# EAGLE design quadcopter (EAGLE 9.7.0)
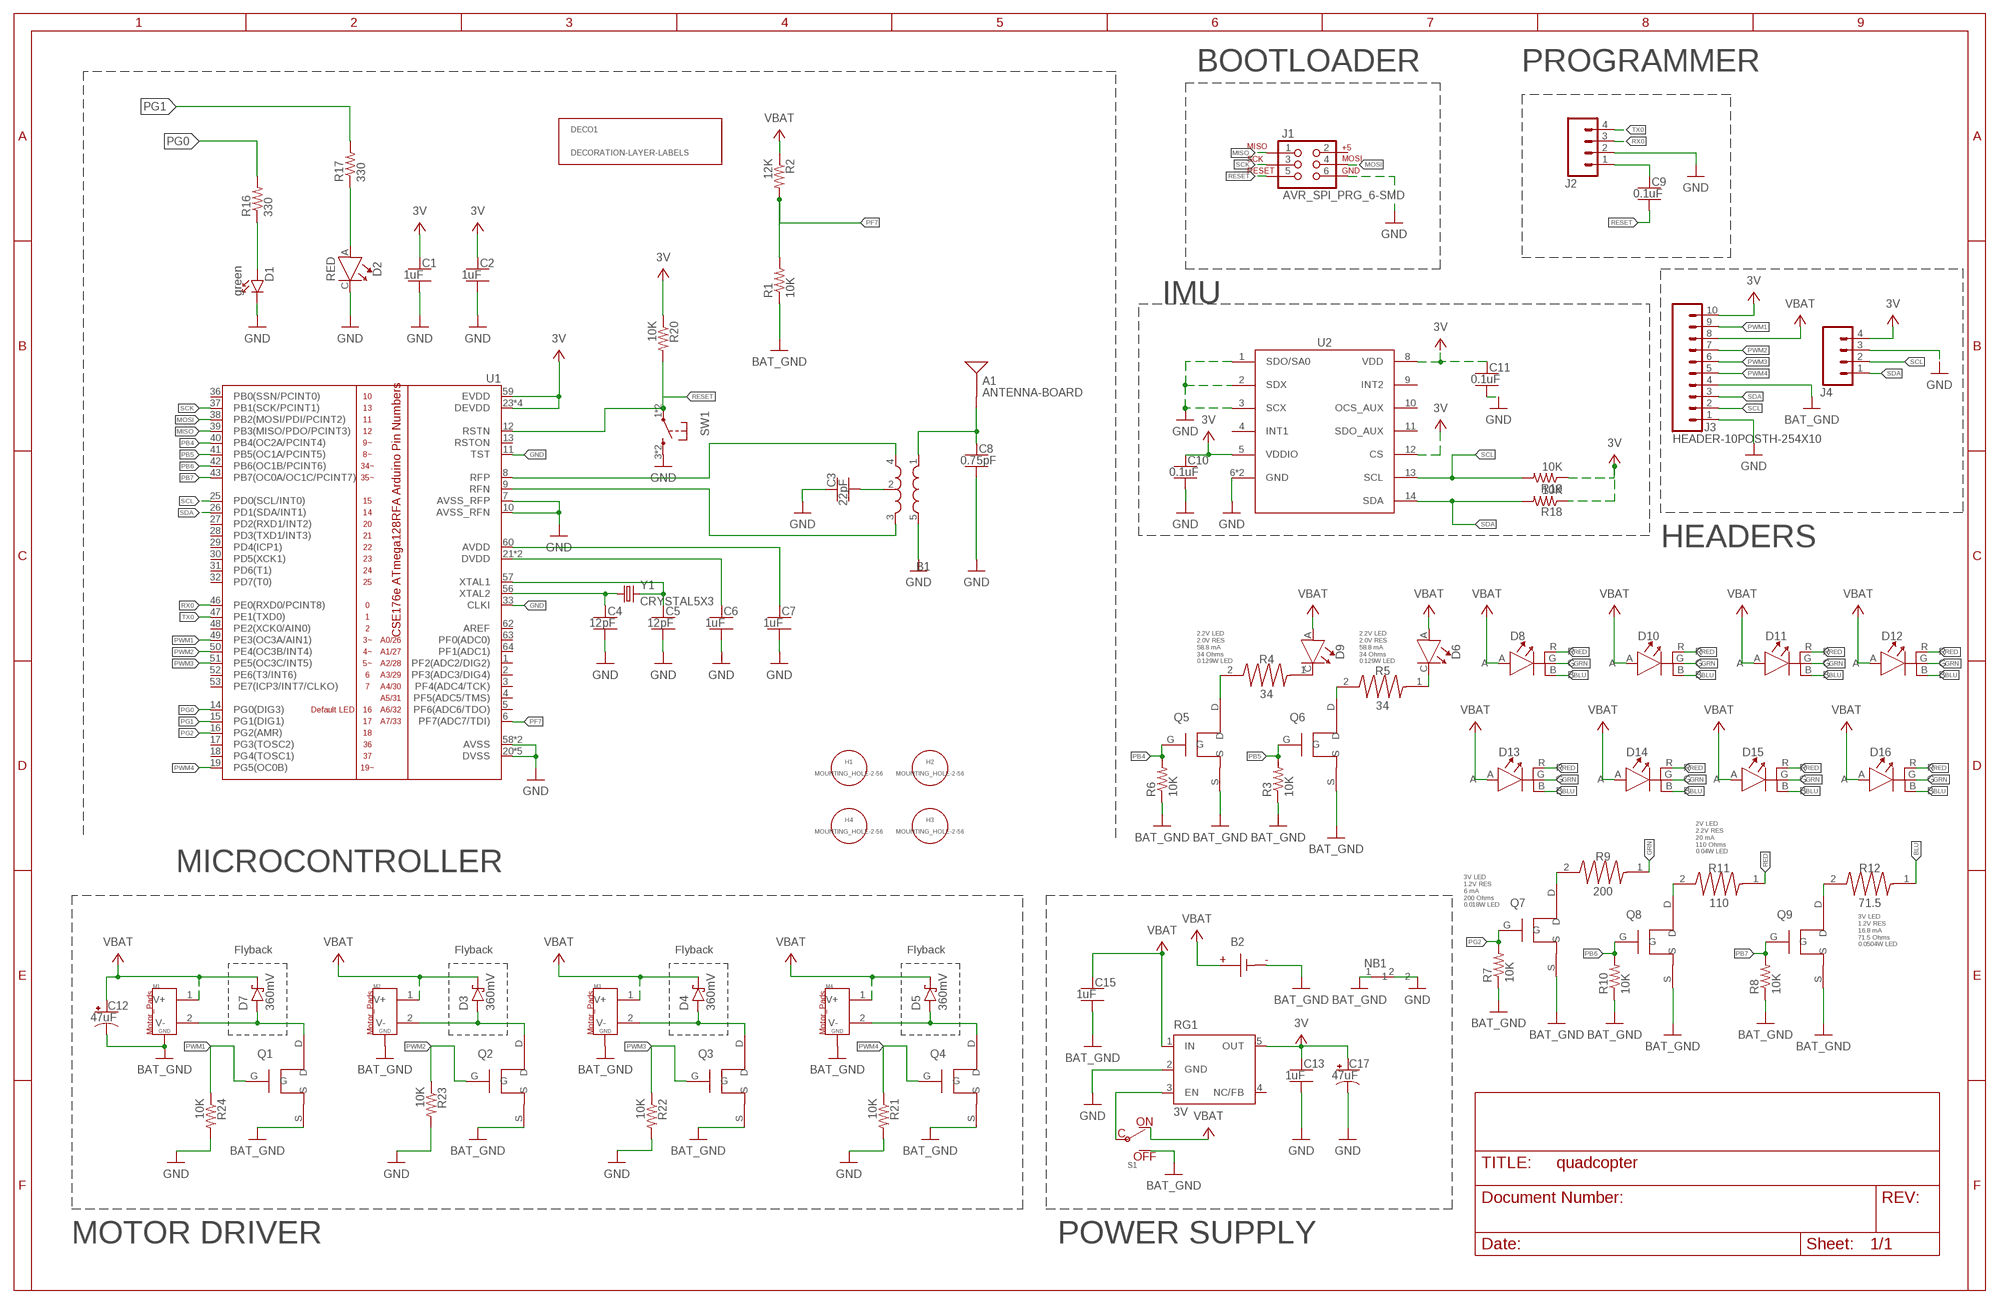
[diagram p0: schematic, sheet 1]
FRAME1 (FRAME_B_L): CREATOR: Unknown; DIST: Unknown; DISTPN: Unknown

## Parts
A1  ANTENNA-BOARD  [ANT_PCB_2.4GHZ_NRF8001_1.6MM_1OZ]
B1  BALUN0805  [BALUN]
B2  BATTERY-SCREW-TERMINAL  [SCREW-TERMINAL-1X2-2.54MM]
C1  1uF  CAPACITOR-NP_SMD-2012-0805_CERAMIC-1UF  [CAPC2012X140_HS]
C2  1uF  CAPACITOR-NP_SMD-2012-0805_CERAMIC-1UF  [CAPC2012X140_HS]
C3  22pF  CAPACITOR-NP_SMD-2012-0805_CERAMIC-22PF  [CAPC2012X140_HS]
C4  12pF  CAPACITOR-NP_SMD-2012-0805_CERAMIC-12PF  [CAPC2012X140_HS]
C5  12pF  CAPACITOR-NP_SMD-2012-0805_CERAMIC-12PF  [CAPC2012X140_HS]
C6  1uF  CAPACITOR-NP_SMD-2012-0805_CERAMIC-1UF  [CAPC2012X140_HS]
C7  1uF  CAPACITOR-NP_SMD-2012-0805_CERAMIC-1UF  [CAPC2012X140_HS]
C8  0.75pF  CAPACITOR-NP_SMD-2012-0805_CERAMIC-0.75PF  [CAPC2012X140_HS]
C9  0.1uF  CAPACITOR-NP_SMD-2012-0805_CERAMIC-0.1UF  [CAPC2012X140_HS]
C10  0.1uF  CAPACITOR-NP_SMD-2012-0805_CERAMIC-0.1UF  [CAPC2012X140_HS]
C11  0.1uF  CAPACITOR-NP_SMD-2012-0805_CERAMIC-0.1UF  [CAPC2012X140_HS]
C12  47uF  CAPACITOR-POL_47UF-SMD-1206-TAJA  [CAPMP3216X180]
C13  1uF  CAPACITOR-NP_SMD-2012-0805_CERAMIC-1UF  [CAPC2012X140_HS]
C15  1uF  CAPACITOR-NP_SMD-2012-0805_CERAMIC-1UF  [CAPC2012X140_HS]
C17  47uF  CAPACITOR-POL_47UF-SMD-1206-TAJA  [CAPMP3216X180]
D1  green  DIODE-LED_SMD-2012-0805-GREEN  [LEDSC125X200X120-2_HS]
D2  RED  LED-RED-LED  [LEDC1507X80]
D3  360mV  DIODE-SCHOTTKY_-SMD-SOD123  [SODFL3516X96]
D4  360mV  DIODE-SCHOTTKY_-SMD-SOD123  [SODFL3516X96]
D5  360mV  DIODE-SCHOTTKY_-SMD-SOD123  [SODFL3516X96]
D6  LED-YELLOW-LED  [LEDQLSP30YK]
D7  360mV  DIODE-SCHOTTKY_-SMD-SOD123  [SODFL3516X96]
D8  RGB-LED-DIFFUSE-LED  [LED150080M153000]
D9  LED-YELLOW-LED  [LEDQLSP30YK]
D10  RGB-LED-DIFFUSE-LED  [LED150080M153000]
D11  RGB-LED-DIFFUSE-LED  [LED150080M153000]
D12  RGB-LED-DIFFUSE-LED  [LED150080M153000]
D13  RGB-LED-DIFFUSE-LED  [LED150080M153000]
D14  RGB-LED-DIFFUSE-LED  [LED150080M153000]
D15  RGB-LED-DIFFUSE-LED  [LED150080M153000]
D16  RGB-LED-DIFFUSE-LED  [LED150080M153000]
DECO1  DECORATION-LAYER-LABELS  [LAYER_LABELS]
H1  MOUNTING_HOLE-2-56  [2-56-MOUNTING-HOLE-NO-METAL]
H2  MOUNTING_HOLE-2-56  [2-56-MOUNTING-HOLE-NO-METAL]
H3  MOUNTING_HOLE-2-56  [2-56-MOUNTING-HOLE-NO-METAL]
H4  MOUNTING_HOLE-2-56  [2-56-MOUNTING-HOLE-NO-METAL]
J1  AVR_SPI_PRG_6-SMD  [2X3-SMD]
J2  HEADER-4POS-0.1IN-FEMALE-SMD-BOTTOM-ENTRY  [HEADER-1X4-BOTTOM-ENTRY]
J3  HEADER-10POSTH-254X10  [HDRV10W63P254_10X1_2540X254H838_HS]
J4  HEADER-4POS-0.1IN-FEMALE-SMD-BOTTOM-ENTRY  [HEADER-1X4-BOTTOM-ENTRY]
M1  MOTOR_PADS_GND-MOLEX-SMD  [MOLEX-0532610271]
M2  MOTOR_PADS_GND-MOLEX-SMD  [MOLEX-0532610271]
M3  MOTOR_PADS_GND-MOLEX-SMD  [MOLEX-0532610271]
M4  MOTOR_PADS_GND-MOLEX-SMD  [MOLEX-0532610271]
NB1  NET-BRIDGE  [NET_BRIDGE]
Q1  MOSFET-SI2302CDS-T1-E3CT-ND  [SOT95P240X110-3MOSFET]
Q2  MOSFET-SI2302CDS-T1-E3CT-ND  [SOT95P240X110-3MOSFET]
Q3  MOSFET-SI2302CDS-T1-E3CT-ND  [SOT95P240X110-3MOSFET]
Q4  MOSFET-SI2302CDS-T1-E3CT-ND  [SOT95P240X110-3MOSFET]
Q5  MOSFET-SI2302CDS-T1-E3CT-ND  [SOT95P240X110-3MOSFET]
Q6  MOSFET-SI2302CDS-T1-E3CT-ND  [SOT95P240X110-3MOSFET]
Q7  MOSFET-SI2302CDS-T1-E3CT-ND  [SOT95P240X110-3MOSFET]
Q8  MOSFET-SI2302CDS-T1-E3CT-ND  [SOT95P240X110-3MOSFET]
Q9  MOSFET-SI2302CDS-T1-E3CT-ND  [SOT95P240X110-3MOSFET]
R1  10K  RESISTOR_SMD-2012-0805-10K  [RESC2012X60_HS]
R2  12K  RESISTOR_SMD-2012-0805-12K  [RESC2012X60_HS]
R3  10K  RESISTOR_SMD-2012-0805-10K  [RESC2012X60_HS]
R4  34  MY-RESISTOR-080534OHMRES  [0805_RESISTOR]
R5  34  MY-RESISTOR-080534OHMRES  [0805_RESISTOR]
R6  10K  RESISTOR_SMD-2012-0805-10K  [RESC2012X60_HS]
R7  10K  RESISTOR_SMD-2012-0805-10K  [RESC2012X60_HS]
R8  10K  RESISTOR_SMD-2012-0805-10K  [RESC2012X60_HS]
R9  200  MY-RESISTOR-805200OHMRES  [0805_RESISTOR]
R10  10K  RESISTOR_SMD-2012-0805-10K  [RESC2012X60_HS]
R11  110  MY-RESISTOR-805110OHMRES  [0805_RESISTOR]
R12  71.5  MY-RESISTOR-080571.5OHMRES  [0805_RESISTOR]
R16  330  RESISTOR_SMD-2012-0805-330  [RESC2012X60_HS]
R17  330  RESISTOR_SMD-2012-0805-330  [RESC2012X60_HS]
R18  10K  RESISTOR_SMD-2012-0805-10K  [RESC2012X60_HS]
R19  10K  RESISTOR_SMD-2012-0805-10K  [RESC2012X60_HS]
R20  10K  RESISTOR_SMD-2012-0805-10K  [RESC2012X60_HS]
R21  10K  RESISTOR_SMD-2012-0805-10K  [RESC2012X60_HS]
R22  10K  RESISTOR_SMD-2012-0805-10K  [RESC2012X60_HS]
R23  10K  RESISTOR_SMD-2012-0805-10K  [RESC2012X60_HS]
R24  10K  RESISTOR_SMD-2012-0805-10K  [RESC2012X60_HS]
RG1  3V  TPS73633-DBVT3V  [SOT23-DBV]
S1  POWER-SWITCH-MFS201N-9-Z-SMD-EDGE  [JS102011SAQN]
SW1  PUSHBUTTON_SMD-VERTICAL-1  [TE_FSM8JSMA_HS]
U1  ATMEGA128RFA1  [QFN-64]
U2  LSM-IMU-497-18367-1-NDIMU  [LSM6DS0-IMU]
Y1  CRYSTAL5X3  [CRYSTAL-SMD-5X3]

## Nets
3V [PWR]: C1.1 C2.1 C10.1 C11.1 C13.1 C17.1(+) J3.10 J4.4 R18.1 R19.1 R20.1 RG1.5(OUT) U1.23(DEVDD) U1.34(DEVDD) U1.44(DEVDD) U1.54(DEVDD) U1.59(EVDD) U2.5(VDDIO) U2.8(VDD) U2.12(CS)
BAT_GND [HIGHCURRENT]: B2.1(N) C12.2(-) C15.2 J3.4 M1.G1(GND) M1.G2(GND) M2.G1(GND) M2.G2(GND) M3.G1(GND) M3.G2(GND) M4.G1(GND) M4.G2(GND) NB1.1 Q1.S Q2.S Q3.S Q4.S Q5.S Q6.S Q7.S Q8.S Q9.S R1.1 R3.1 R6.1 R7.1 R8.1 R10.1 S1.A(OFF)
BLU: D8.B D10.B D11.B D12.B D13.B D14.B D15.B D16.B R12.1
GND [PWR]: B1.5(GND) C1.2 C2.2 C3.1 C4.2 C5.2 C6.2 C7.2 C8.2 C10.2 C11.2 C13.2 C17.2(-) D1.C D2.C J1.6 J2.2 J3.1 J4.3 NB1.2 R21.2 R22.2 R23.2 R24.2 RG1.2(GND) SW1.3 SW1.4 U1.7(AVSS_RFP) U1.10(AVSS_RFN) U1.11(TST) U1.20(DVSS) U1.24(DVSS) U1.33(CLKI) U1.35(DVSS) U1.45(DVSS) U1.55(DVSS) U1.58(AVSS) U1.61(AVSS) U2.1(SDO/SA0) U2.2(SDX) U2.3(SCX) U2.6(GND) U2.7(GND)
GRN: D8.G D10.G D11.G D12.G D13.G D14.G D15.G D16.G R9.1
MISO: J1.1 U1.39(PB3(MISO/PDO/PCINT3))
MOSI: J1.4 U1.38(PB2(MOSI/PDI/PCINT2))
N$1: D1.A R16.1
N$2: D2.A R17.1
N$3: B1.4(OUT1) U1.8(RFP)
N$4: B1.3(OUT2) U1.9(RFN)
N$5: B1.2(GND) C3.2
N$6: C5.1 U1.57(XTAL1) Y1.3
N$7: C4.1 U1.56(XTAL2) Y1.1
N$8: C7.1 U1.60(AVDD)
N$9: C6.1 U1.21(DVDD) U1.22(DVDD)
N$10 [RFSIG]: A1.FEED(SIGNAL) B1.1(IN) C8.1
N$11: C9.1 J2.1
N$12: D9.C R4.1
N$13: Q6.D R5.2
N$14 [HIGHCURRENT]: D7.2(A) M1.2(V-) Q1.D
N$15 [HIGHCURRENT]: D3.2(A) M2.2(V-) Q2.D
N$16 [HIGHCURRENT]: D4.2(A) M3.2(V-) Q3.D
N$17 [HIGHCURRENT]: D5.2(A) M4.2(V-) Q4.D
N$18: D6.C R5.1
N$19: Q7.D R9.2
N$20: RG1.3(EN) S1.C
N$22: Q8.D R11.2
N$23: Q5.D R4.2
N$25: Q9.D R12.2
PB4: Q5.G R6.2 U1.40(PB4(OC2A/PCINT4))
PB5: Q6.G R3.2 U1.41(PB5(OC1A/PCINT5))
PB6: Q8.G R10.2 U1.42(PB6(OC1B/PCINT6))
PB7: Q9.G R8.2 U1.43(PB7(OC0A/OC1C/PCINT7))
PF7: R1.2 R2.2 U1.6(PF7(ADC7/TDI))
PG0: R16.2 U1.14(PG0(DIG3))
PG1: R17.2 U1.15(PG1(DIG1))
PG2: Q7.G R7.2 U1.16(PG2(AMR))
PWM1: J3.9 Q1.G R24.1 U1.49(PE3(OC3A/AIN1))
PWM2: J3.7 Q2.G R23.1 U1.50(PE4(OC3B/INT4))
PWM3: J3.6 Q3.G R22.1 U1.51(PE5(OC3C/INT5))
PWM4: J3.5 Q4.G R21.1 U1.19(PG5(OC0B))
RED: D8.R D10.R D11.R D12.R D13.R D14.R D15.R D16.R R11.1
RESET: C9.2 J1.5 R20.2 SW1.1 SW1.2 U1.12(RSTN)
RX0: J2.3 U1.46(PE0(RXD0/PCINT8))
SCK: J1.3 U1.37(PB1(SCK/PCINT1))
SCL: J3.2 J4.2 R19.2 U1.25(PD0(SCL/INT0)) U2.13(SCL)
SDA: J3.3 J4.1 R18.2 U1.26(PD1(SDA/INT1)) U2.14(SDA)
TX0: J2.4 U1.47(PE1(TXD0))
VBAT [HIGHCURRENT]: B2.2(P) C12.1(+) C15.1 D3.1(C) D4.1(C) D5.1(C) D6.A D7.1(C) D8.A D9.A D10.A D11.A D12.A D13.A D14.A D15.A D16.A J3.8 M1.1(V+) M2.1(V+) M3.1(V+) M4.1(V+) R2.1 RG1.1(IN) S1.B(ON)
Unconnected: J1.2 RG1.4(NC/FB) U1.1(PF2(ADC2/DIG2)) U1.2(PF3(ADC3/DIG4)) U1.3(PF4(ADC4/TCK)) U1.4(PF5(ADC5/TMS)) U1.5(PF6(ADC6/TDO)) U1.13(RSTON) U1.17(PG3(TOSC2)) U1.18(PG4(TOSC1)) U1.27(PD2(RXD1/INT2)) U1.28(PD3(TXD1/INT3)) U1.29(PD4(ICP1)) U1.30(PD5(XCK1)) U1.31(PD6(T1)) U1.32(PD7(T0)) U1.36(PB0(SSN/PCINT0)) U1.48(PE2(XCK0/AIN0)) U1.52(PE6(T3/INT6)) U1.53(PE7(ICP3/INT7/CLKO)) U1.62(AREF) U1.63(PF0(ADC0)) U1.64(PF1(ADC1)) U2.4(INT1) U2.9(INT2) U2.10(OCS_AUX) U2.11(SDO_AUX)

## Notes on the sheet
- BOOTLOADER
- PROGRAMMER
- IMU
- HEADERS
- 2.2V LED
  2.0V RES
  58.8 mA
  34 Ohms
  0.129W LED
- 2.2V LED
  2.0V RES
  58.8 mA
  34 Ohms
  0.129W LED
- 2V LED
  2.2V RES
  20 mA
  110 Ohms
  0.04W LED
- MICROCONTROLLER
- 3V LED
  1.2V RES
  6 mA
  200 Ohms
  0.018W LED
- Flyback | Flyback | Flyback | Flyback
- 3V LED
  1.2V RES
  16.8 mA
  71.5 Ohms
  0.0504W LED
- MOTOR DRIVER | POWER SUPPLY

## Library data of the parts
A1 = quadparts_prebuilt_2022:ANTENNA: Single endded antenna.; CREATOR: Swanson; DESC: trace antenna; DIST: NA; DISTPN: NA; MFR: NA; MOUNTING: NONE; MPN: NA; POPULATE: NO
B1 = quadparts_prebuilt_2022:BALUN: A balun to convert differential radio-frequency outputs from the microcontroller into a single-ended driver for the antenna.; CREATOR: Swanson; DATASHEET: http://katalog.we-online.de/pbs/datasheet/748421245.pdf; DESC: BALUN 2.4GHZ-2.5GHZ 50/100 0805; DIST: Digikey; DISTPN: 732-2230-1-ND; MFR: Wurth Electronics Inc.; MOUNTING: SMD; MPN: 748421245; PACKAGE: 0805; PRICE: 2.63; REVIEWER: Swanson
B2 = quadparts_prebuilt_2022:BATTERY: Connections for a battery.; CREATOR: Swanson; DIST: DIGIKEY; DISTPN: ED10561-ND; MOUNTING: TH; PIN1: -; PIN2: +
C1 C2 C6 C7 C13 C15 = quadparts_prebuilt_2022:CAPACITOR-NP_: Nonpolarized capacitor; CREATOR: Swanson; DIST: Digikey; DISTPN: 587-1281-1-ND; MFR: Taiyo Yuden; MOUNTING: SMD; MPN: TMK212B7105KG-T; REVIEWER: Swanson
C3 = quadparts_prebuilt_2022:CAPACITOR-NP_: Nonpolarized capacitor; CREATOR: Swanson; DESC: CAP CER 22PF 250V C0G/NP0 0805; DIST: Digikey; DISTPN: 490-5534-1-ND; MFR: Murata Electronics; MOUNTING: SMD; MPN: GRM21A5C2E220JW01D; PACKAGE: 0805; REVIEWER: Swanson
C4 C5 = quadparts_prebuilt_2022:CAPACITOR-NP_: Nonpolarized capacitor; CREATOR: Swanson; DESC: CAP CER 12PF 250V C0G/NP0 0805; DIST: Digikey; DISTPN: 490-5531-1-ND; MFR: Murata Electronics; MOUNTING: SMD; MPN: GRM21A5C2E120JW01D; PACKAGE: 0805; REVIEWER: Swanson
C8 = quadparts_prebuilt_2022:CAPACITOR-NP_: Nonpolarized capacitor; CREATOR: Swanson; DESC: CAP CER 0.75PF 100V C0G/NP0 0805; DIST: Digikey; DISTPN: 490-3585-1-ND; MFR: Murata Electronics; MOUNTING: SMD; MPN: GQM2195C2AR75CB01D; PACKAGE: 0805; REVIEWER: Swanson
C9-C11 = quadparts_prebuilt_2022:CAPACITOR-NP_: Nonpolarized capacitor; CREATOR: Swanson; DESC: CAP CER 0.1UF 100V X7R 0805; DIST: Digikey; DISTPN: 445-1418-1-ND; MFR: TDK Corporation; MOUNTING: SMD; MPN: C2012X7R2A104K125AA; PACKAGE: 0805; REVIEWER: Swanson
C12 C17 = quadparts_prebuilt_2022:CAPACITOR-POL_: Polarized capacitor; CREATOR: Swanson; DESC: CAP TANT 47UF 10% 6.3V 1206; DIST: DIGIKEY; DISTPN: 478-11462-1-ND; MFR: AVX Corporation; MOUNTING: SMD; MPN: TAJA476K006SNJV; PACKAGE: 1206
D1 = quadparts_prebuilt_2022:DIODE-LED_: Light emitting diode; CREATOR: Swanson; DIST: Digikey; DISTPN: 160-1179-1-ND; MFR: Lite-On Inc; MOUNTING: SMD; MPN: LTST-C170GKT; REVIEWER: Swanson
D2 = custom_:LED; CREATOR: ELENA; DIST: Digikey; DISTPN: 160-1178-1-ND
D3-D5 D7 = quadparts_prebuilt_2022:DIODE-SCHOTTKY_: Schottky diode; CREATOR: Swanson; DESC: DIODE SCHOTTKY 30V 1.5A SFLAT; DIST: Digikey; DISTPN: CRS08QMCT-ND; MFR: Toshiba Semiconductor and Storage; MOUNTING: SMD; MPN: CRS08(TE85L,Q,M); REVIEWER: Swanson
D6 D9 = LED:LED; CREATOR: Elaine Chao; DIST: DigiKey; DISTPN: 3970-QLSP30YKCT-ND
D8 D10-D16 = LED:RGB-LED; CREATOR: Elaine Chao; DIST: DigiKey; DISTPN: 732-11392-1-ND
DECO1 = quadparts_prebuilt_2022:DECORATION
H1-H4 = quadparts_prebuilt_2022:MOUNTING_HOLE
J1 = quadparts_prebuilt_2022:AVR_SPI_PRG_6: AVR ISP 6 Pin This is the in-system programming (ISP) connector for Atmel Microcontrollers programming.; CREATOR: Swanson; DESC: CONN HEADER SMD 6POS 2.54MM; DIST: Digikey; DISTPN: 609-3487-2-ND; MFR: Amphenol ICC (FCI); MOUNTING: SMD; MPN: 95278-101A06LF
J2 J4 = quadparts_prebuilt_2022:HEADER-4POS; CREATOR: Swanson; DESC: CONN RCPT 4POS 0.1 GOLD SMD; DIST: DIGIKEY; DISTPN: A121787CT-ND; MFR: TE Connectivity AMP Connectors; MOUNTING: SMD; MPN: 1241152-4
J3 = quadparts_prebuilt_2022:HEADER-10POS: 10 pin single inline pin header, socket, or connector; CREATOR: Swanson; DATASHEET: http://portal.fciconnect.com/Comergent//fci/drawing/68000.pdf; DIST: Digikey; DISTPN: 609-3250-ND; MFR: Amphenol FCI; MOUNTING: TH; MPN: 68000-110HLF; PRICE: 0.55; REVIEWER: Swanson
M1-M4 = quadparts_prebuilt_2022:MOTOR_PADS_GND: Connections a brushed motor.; CREATOR: Swanson; DESC: CONN HEADER SMD R/A 2POS 1.25MM; DIST: DIGIKEY; DISTPN: WM7620CT-ND; MFR: Molex; MOUNTING: SMD; MPN: 532610271
NB1 = custom_:NET-BRIDGE; CREATOR: ELAINE; DIST: NA; DISTPN: NA
Q1-Q9 = custom_:MOSFET; CREATOR: ELENA; DIST: Digikey; DISTPN: SI2302CDS-T1-E3CT-ND
R1 R3 R6-R8 R10 R18-R24 = quadparts_prebuilt_2022:RESISTOR_: Resistor; CREATOR: Swanson; DESC: RES SMD 10K OHM 5% 1/8W 0805; DIST: Digikey; DISTPN: 311-10KARCT-ND; MFR: Yageo; MOUNTING: SMD; MPN: RC0805JR-0710KL; PACKAGE: 0805; REVIEWER: Swanson
R2 = quadparts_prebuilt_2022:RESISTOR_: Resistor; CREATOR: Swanson; DIST: DIGIKEY; DISTPN: YAG3692CT-ND; MOUNTING: SMD
R4 R5 = custom_:MY-RESISTOR; CREATOR: Elaine Chao; DIST: DigiKey; DISTPN: 311-34.0CRCT-ND
R9 = custom_:MY-RESISTOR; CREATOR: Elaine Chao; DIST: DigiKey; DISTPN: 311-200CRCT-ND
R11 = custom_:MY-RESISTOR; CREATOR: Elaine Chao; DIST: DigiKey; DISTPN: 311-110CRCT-ND
R12 = custom_:MY-RESISTOR; CREATOR: Elaine Chao; DIST: DigiKey; DISTPN: 311-71.5CRCT-ND
R16 R17 = quadparts_prebuilt_2022:RESISTOR_: Resistor; CREATOR: Swanson; DIST: Digikey; DISTPN: 311-330ARCT-ND; MFR: Yageo; MOUNTING: SMD; MPN: RC0805JR-07330RL; REVIEWER: Swanson
RG1 = quadparts_prebuilt_2022:TPS73633-DBVT: LP3985-series voltage regulators.; CREATOR: Swanson; DATASHEET: http://www.ti.com/lit/ds/symlink/lp3985.pdf; DIST: Digikey; DISTPN: LP3985IM5X-3.0/NOPBCT-ND; MFR: Texas Instruments; MOUNTING: SMD; MPN: LP3985IM5X-3.0/NOPB; PRICE: 0.59; REVIEWER: Swanson
S1 = quadparts_prebuilt_2022:POWER-SWITCH-MFS201N-9-Z; CREATOR: Swanson; DESC: SWITCH SLIDE SPDT 300MA 6V; DIST: DIGIKEY; DISTPN: 401-1999-1-ND; MFR: C&K; MOUNTING: SMD; MPN: JS102011SAQN
SW1 = quadparts_prebuilt_2022:PUSHBUTTON_: "Tactile" or "clicky" button.; CREATOR: Swanson; DIST: Digikey; DISTPN: 450-1129-ND; MFR: TE Connectivity Alcoswitch Switches; MOUNTING: SMD; MPN: FSM4JSMA; REVIEWER: Swanson
U1 = quadparts_prebuilt_2022:ATMEGA128RFA1: ATmega128RFA1 8-bit AVR Microcontroller with Low Power 2.4GHz Transceiver for ZigBee and IEEE 802.15.4; CREATOR: Swanson; DATASHEET: http://www.atmel.com/Images/Atmel-8266-MCU_Wireless-ATmega128RFA1_Datasheet.pdf; DESC: IC RF TXRX+MCU 802.15.4 64VFQFN; DIST: Digikey; DISTPN: ATMEGA128RFA1-ZU-ND; MFR: Microchip Technology; MOUNTING: SMD; MPN: ATMEGA128RFA1-ZU; PACKAGE: QFN; PRICE: 10.21; REVIEWER: Swanson
U2 = custom_:LSM-IMU; CREATOR: ELENA; DIST: Digikey; DISTPN: 497-18367-1-ND
Y1 = quadparts_prebuilt_2022:CRYSTAL: Crystals to provide clock references for microcontrollers, etc.; CREATOR: Swanson; DATASHEET: http://www.abracon.com/Resonators/abm3b.pdf; DESC: CRYSTAL 16.0000MHZ 18PF SMD; DIST: Digikey; DISTPN: 535-9122-1-ND; MFR: Abracon LLC; MOUNTING: SMD; MPN: ABM3B-16.000MHZ-B2-T; PRICE: 0.68; PROD_ID: XTAL-08218; REVIEWER: Swanson

## Net classes
1 RFSIG: width 1.27 mm
2 PWR: width 0.254 mm
3 HIGHCURRENT: width 0.762 mm, drill 0.61 mm

## Board
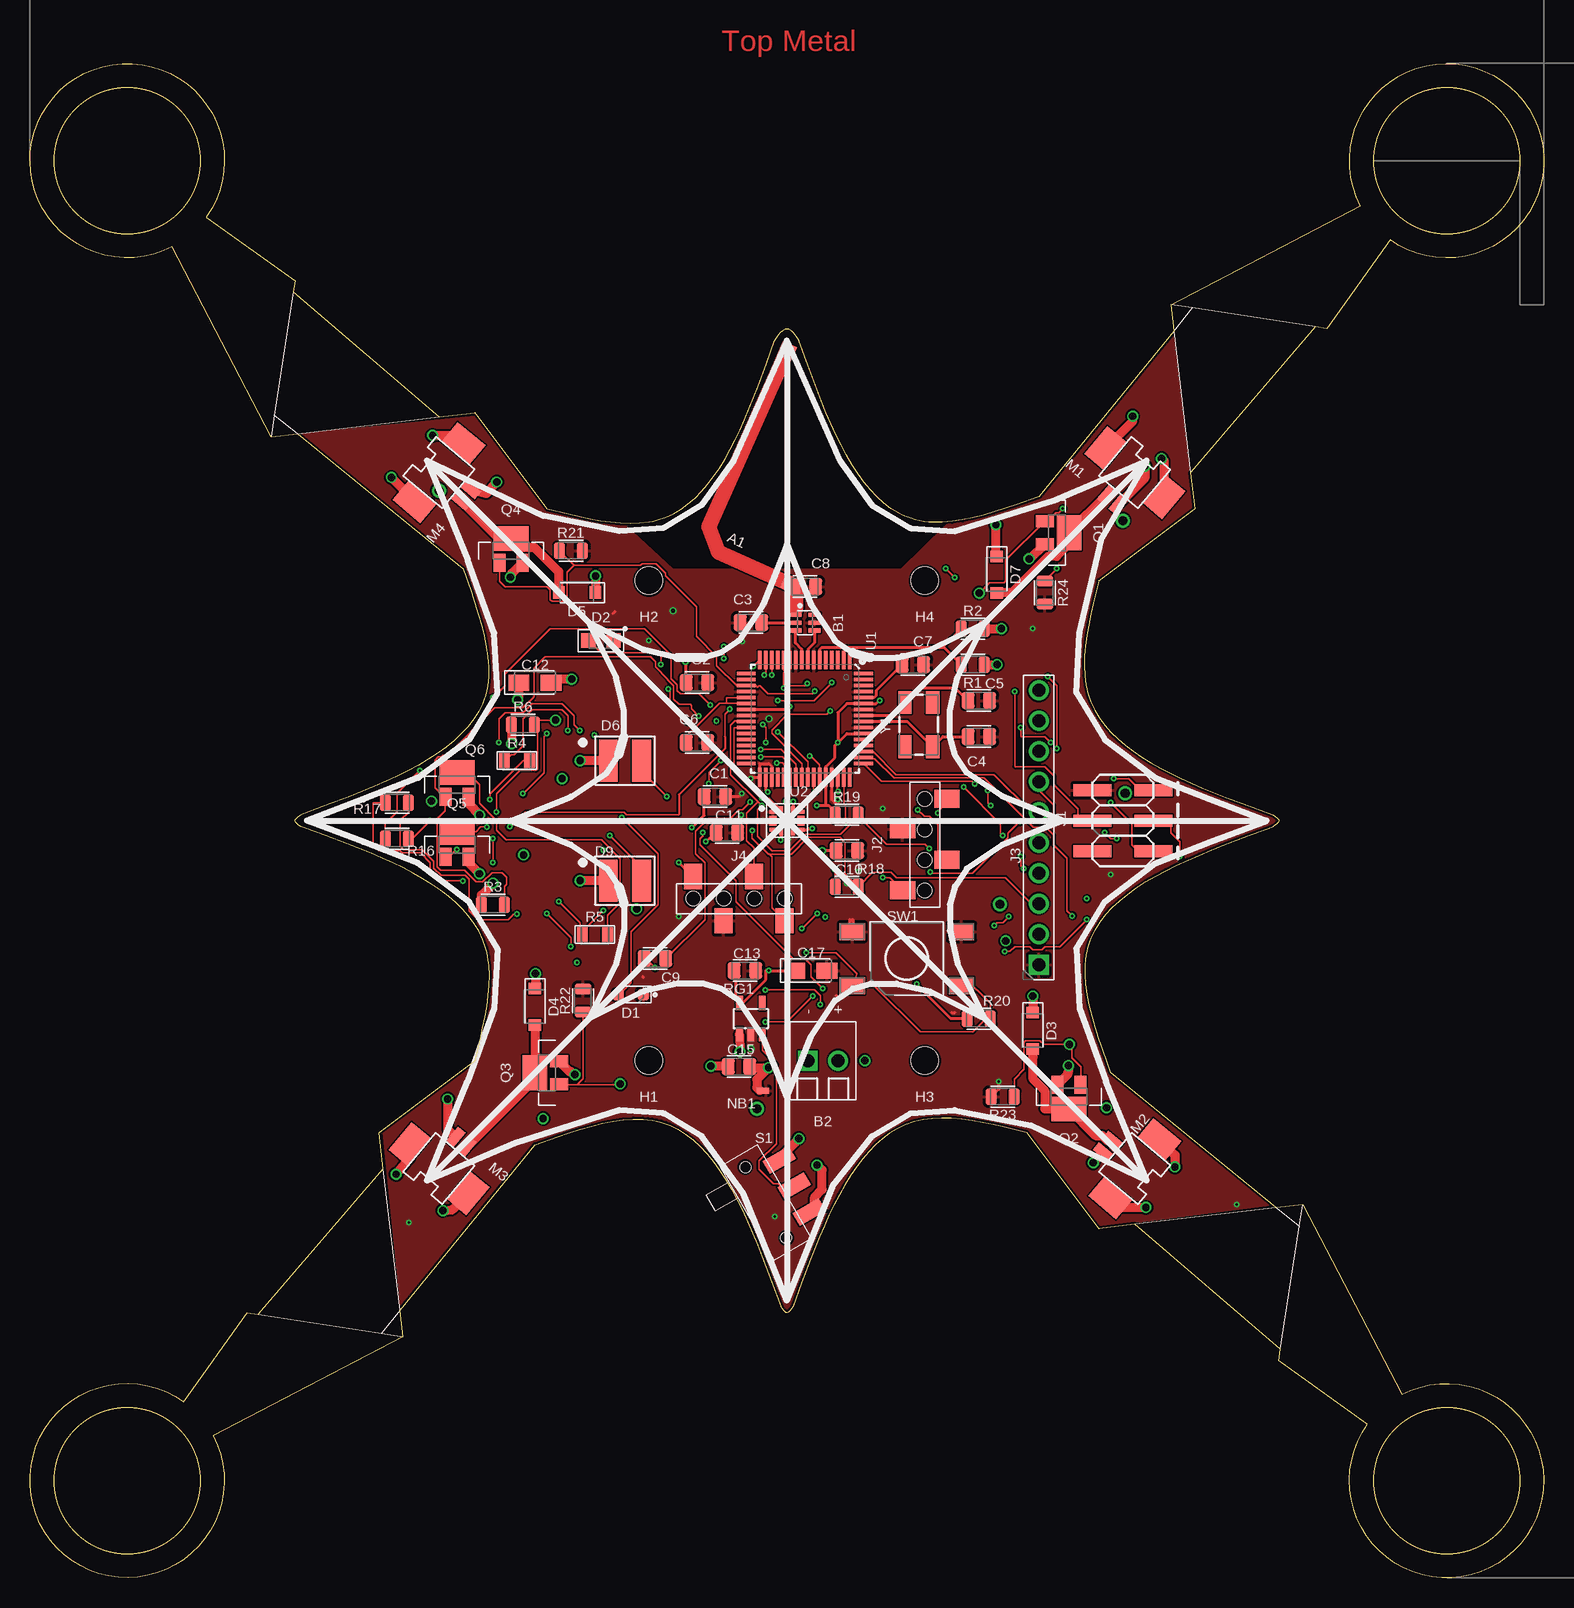
[diagram p1: board, top side]
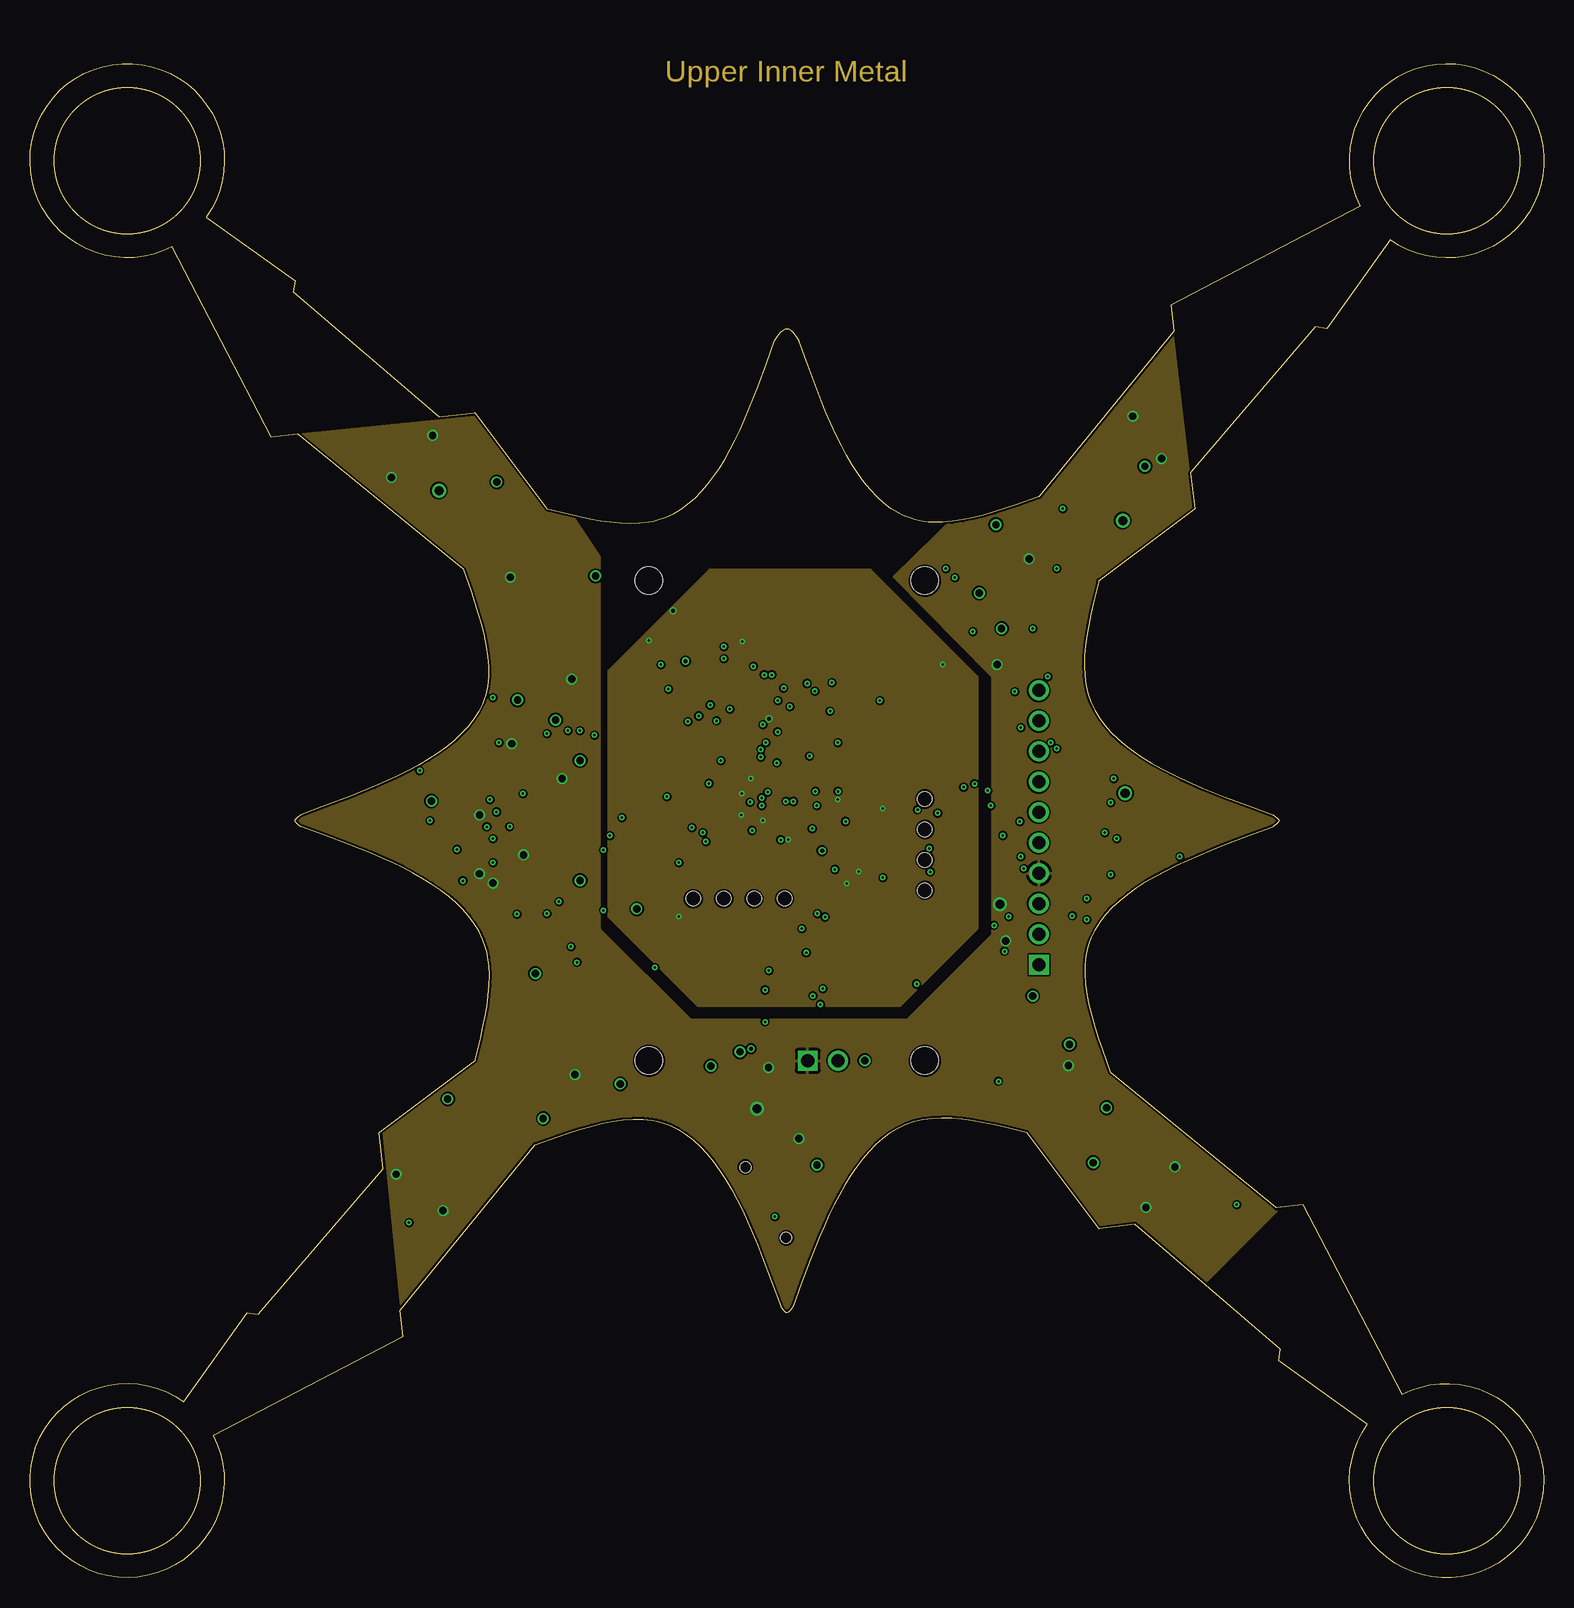
[diagram p2: board, inner layer Route2]
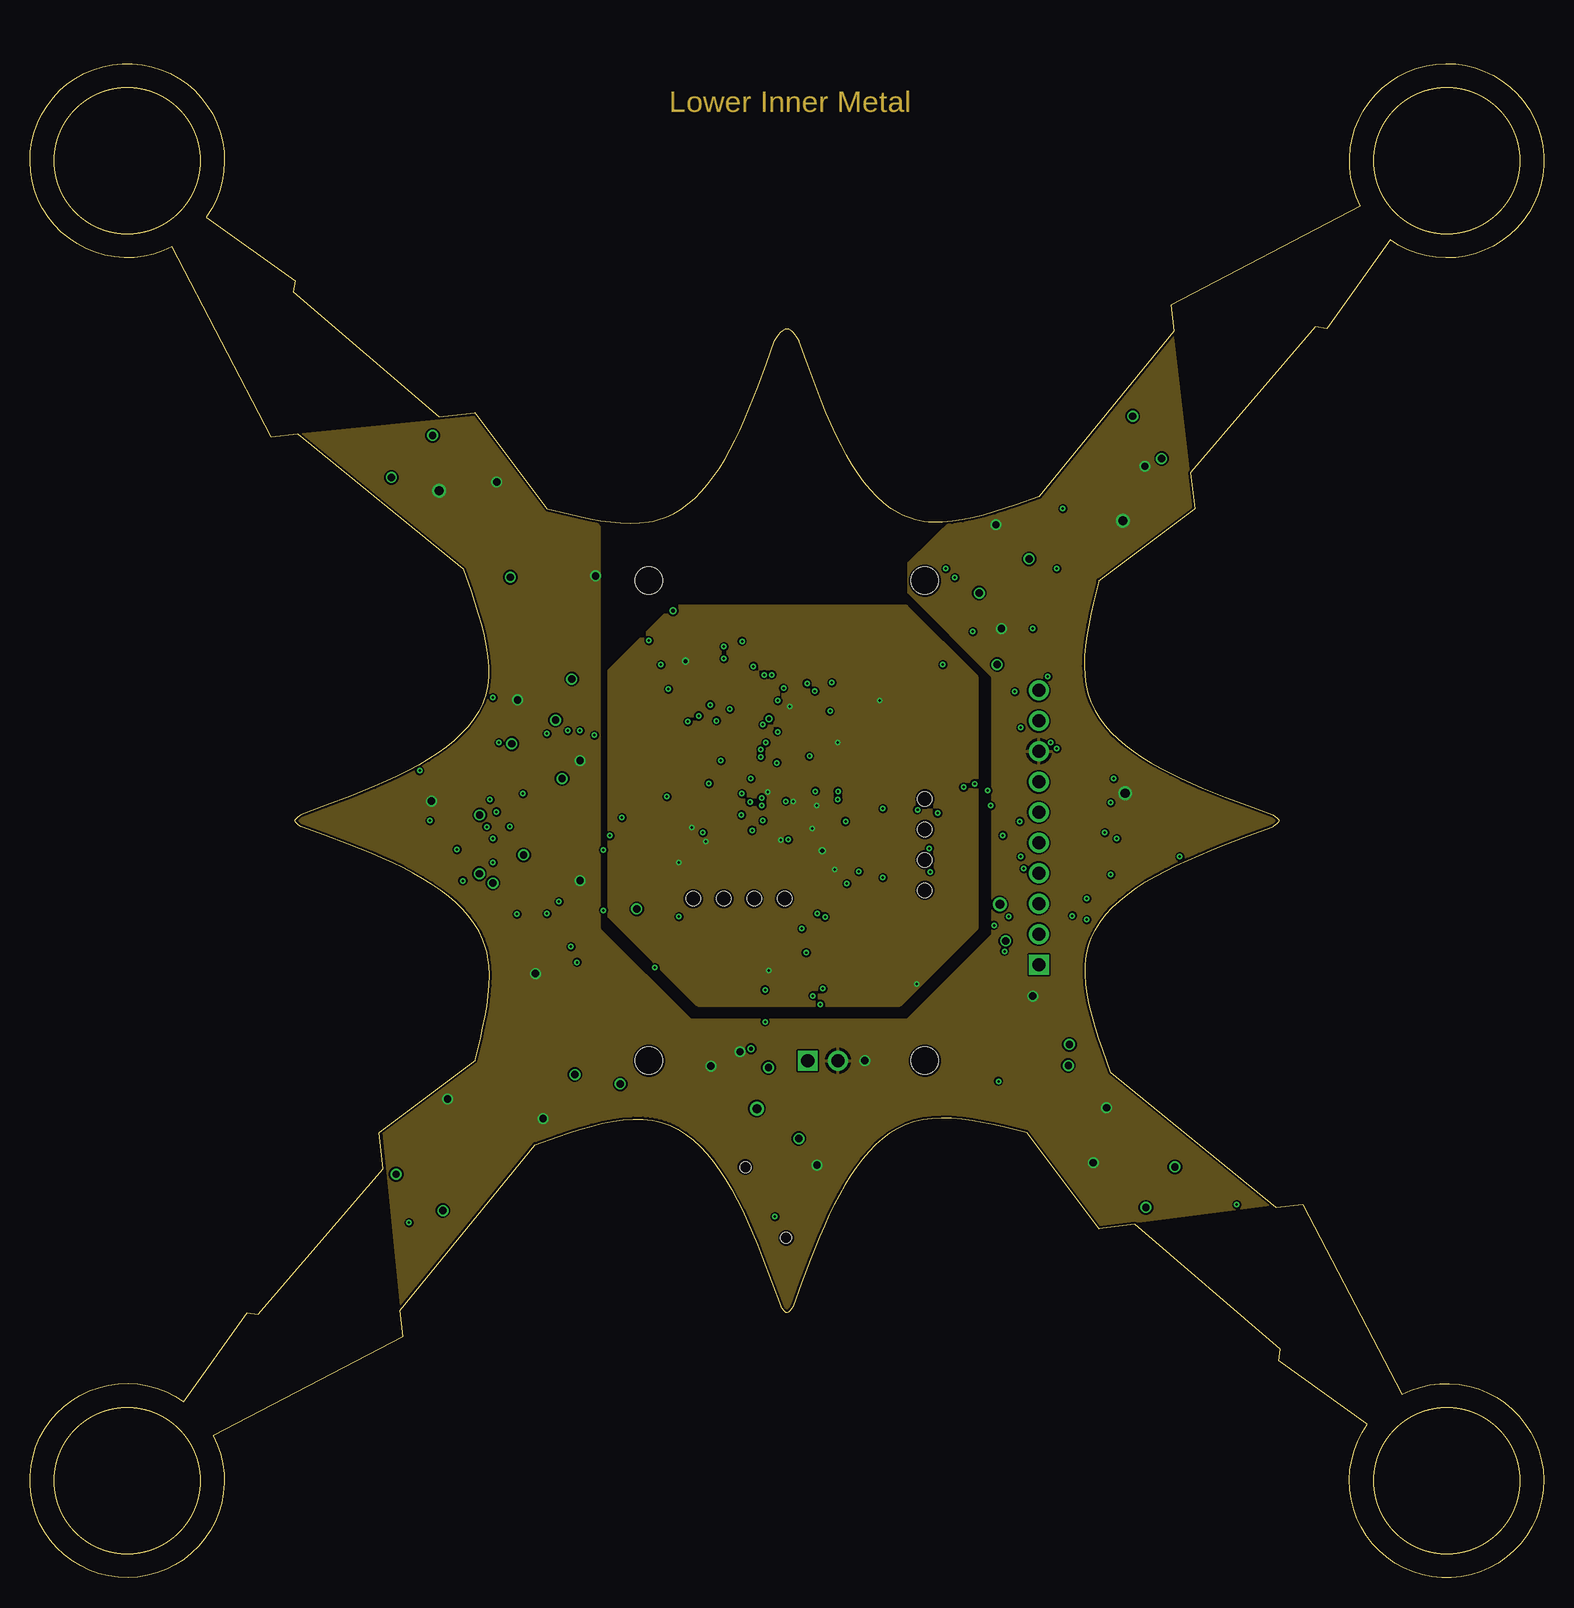
[diagram p3: board, inner layer Route15]
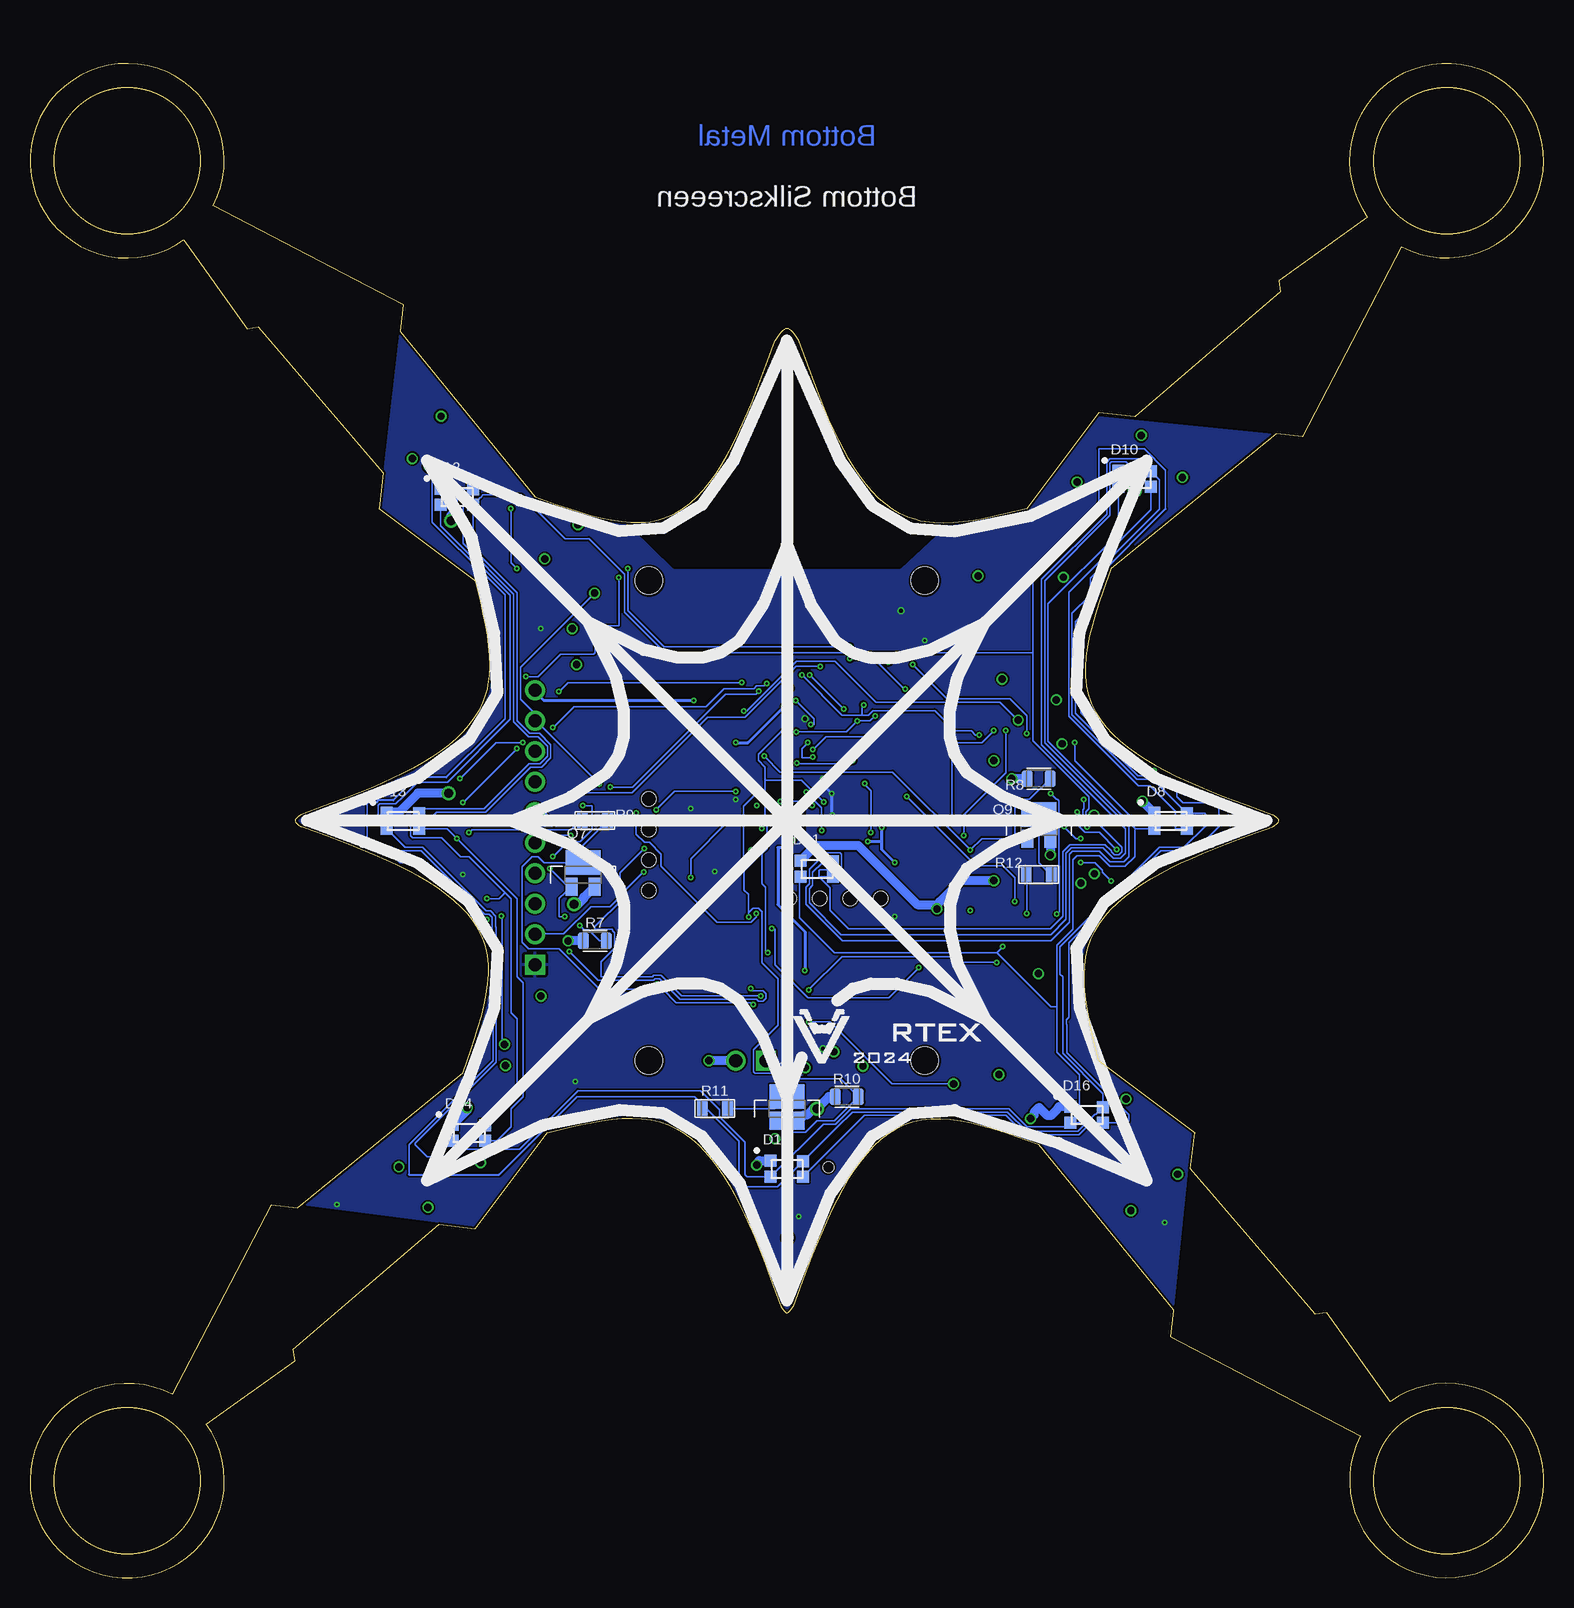
[diagram p4: board, bottom side, seen from below]

Size 126.19 x 126.19 mm. Coordinates in mm from the lower left corner, seen from the top.
Outline: 326 segments
Outline: circle at 118.1,118.1 radius 6.1
Outline: circle at 118.1,8.1 radius 6.1
Outline: circle at 8.1,8.1 radius 6.1
Outline: circle at 8.1,118.1 radius 6.1
Copper layers (1*2*15*16): Top 0.035559375mm / dielectric 1.501140625mm / Route2 0.035559375mm / dielectric 0.149859375mm / Route15 0.035559375mm / dielectric 0.200659375mm / Bottom 0.035559375mm
Design rules "pcbcart-4layer-5mil-small-cream.dru": minimum track width 5mil, minimum drill 8mil, track to track 6mil, track to pad 6mil, pad to pad 6mil, via to via 6mil, smd to smd 6mil, copper to edge 0.2mm, drill to drill 10mil, minimum pad ring 5mil, minimum via ring 5mil, stop-mask expansion 3mil, vias tented up to drill 0.45mm, thermal gap 10mil

### Footprints (pad centres in the part's own frame; a part is rotated, then mirrored left to right if it is on the bottom)
ANT_PCB_2.4GHZ_NRF8001_1.6MM_1OZ = smd 1.27 x 1.27: FEED 0,0; TESTPOINT -8.169,17.605
BALUN = smd 0.35 x 1: 1 -0.65,-0.8; 2 0,-0.8; 3 0.65,-0.8; 4 0.65,0.8; 5 0,0.8; 6 -0.65,0.8
SCREW-TERMINAL-1X2-2.54MM = drill 1.1 square: 1 -1.27,0 | drill 1.1: 2 1.27,0
CAPC2012X140_HS = smd 1.08 x 1.42: 1 -0.895,0; 2 0.895,0
CAPMP3216X180 = smd 1.735 x 1.315: 1 -1.34,0; 2 1.34,0
LEDSC125X200X120-2_HS = smd 0.94 x 0.99: A -1.045,0; C 1.045,0
LEDC1507X80 = smd 1.2 x 1.2: A -1.05,0; C 1.05,0
SODFL3516X96 = smd 0.962 x 1.029: 1 -1.525,0; 2 1.525,0
LEDQLSP30YK = smd 1.55 x 3.5: A -1.385,0; C 1.385,0
LED150080M153000 = smd 1 x 1: A -1.35,0.675; B -1.35,-0.675; G 1.35,-0.675; R 1.35,0.625
2-56-MOUNTING-HOLE-NO-METAL = hole 2.261: 0,0
2X3-SMD = smd 1 x 3.15: 1 -2.54,-2.54; 2 -2.54,2.54; 3 0,-2.54; 4 0,2.54; 5 2.54,-2.54; 6 2.54,2.54
HEADER-1X4-BOTTOM-ENTRY = smd 1.5 x 2.1: 1 3.81,-1.85; 2 1.27,1.85; 3 -1.27,-1.85; 4 -3.81,1.85 | hole 1.2: -1.27,0; -3.81,0; 1.27,0; 3.81,0
HDRV10W63P254_10X1_2540X254H838_HS = drill 1.1 pad 1.65 square: 1 0,0 | drill 1.1 pad 1.65: 2 2.54,0; 3 5.08,0; 4 7.62,0; 5 10.16,0; 6 12.7,0; 7 15.24,0; 8 17.78,0; 9 20.32,0; 10 22.86,0
MOLEX-0532610271 = smd 0.8 x 1.6: 1 -0.637,2.9; 2 0.613,2.9 | smd 2.1 x 3: G1 -3.175,0; G2 3.175,0
NET_BRIDGE = smd 0.5 x 0.5: 1 -0.25,0; 2 0.25,0
SOT95P240X110-3MOSFET = smd 2.9 x 2.05: D 0,1.025 | smd 1 x 1.5: G -0.95,-1; S 0.95,-1
RESC2012X60_HS = smd 0.92 x 1.38: 1 -0.955,0; 2 0.955,0
0805_RESISTOR = smd 0.9 x 1.2: 1 -1.05,0; 2 1.05,0
SOT23-DBV = smd 0.55 x 1.2: 1 -0.95,-1.3; 2 0,-1.3; 3 0.95,-1.3; 4 0.95,1.3; 5 -0.95,1.3
JS102011SAQN = smd 1.2 x 2.5: A -2.5,2.75; B 2.5,2.75; C 0,2.75 | hole 0.9: -3.4,0; 3.4,0
TE_FSM8JSMA_HS = smd 1.4 x 2.1: 1 -2.25,4.55; 2 -2.25,-4.55; 3 2.25,4.55; 4 2.25,-4.55
QFN-64 = smd 1.562 x 0.28: 1 -4.881,3.75; 2 -4.881,3.25; 3 -4.881,2.75; 4 -4.881,2.25; 5 -4.881,1.75; 6 -4.881,1.25; 7 -4.881,0.75; 8 -4.881,0.25; 9 -4.881,-0.25; 10 -4.881,-0.75; 11 -4.881,-1.25; 12 -4.881,-1.75; 13 -4.881,-2.25; 14 -4.881,-2.75; 15 -4.881,-3.25; 16 -4.881,-3.75; 33 4.881,-3.75; 34 4.881,-3.25; 35 4.881,-2.75; 36 4.881,-2.25; 37 4.881,-1.75; 38 4.881,-1.25; 39 4.881,-0.75; 40 4.881,-0.25; 41 4.881,0.25; 42 4.881,0.75; 43 4.881,1.25; 44 4.881,1.75; 45 4.881,2.25; 46 4.881,2.75; 47 4.881,3.25; 48 4.881,3.75 | smd 0.28 x 1.562: 17 -3.75,-4.881; 18 -3.25,-4.881; 19 -2.75,-4.881; 20 -2.25,-4.881; 21 -1.75,-4.881; 22 -1.25,-4.881; 23 -0.75,-4.881; 24 -0.25,-4.881; 25 0.25,-4.881; 26 0.75,-4.881; 27 1.25,-4.881; 28 1.75,-4.881; 29 2.25,-4.881; 30 2.75,-4.881; 31 3.25,-4.881; 32 3.75,-4.881; 49 3.75,4.881; 50 3.25,4.881; 51 2.75,4.881; 52 2.25,4.881; 53 1.75,4.881; 54 1.25,4.881; 55 0.75,4.881; 56 0.25,4.881; 57 -0.25,4.881; 58 -0.75,4.881; 59 -1.25,4.881; 60 -1.75,4.881; 61 -2.25,4.881; 62 -2.75,4.881; 63 -3.25,4.881; 64 -3.75,4.881
LSM6DS0-IMU = smd 0.575 x 0.34: 1 -1.163,0.75; 2 -1.163,0.25; 3 -1.163,-0.25; 4 -1.163,-0.75; 8 1.163,-0.75; 9 1.163,-0.25; 10 1.163,0.25; 11 1.163,0.75 | smd 0.34 x 0.575: 5 -0.5,-0.912; 6 0,-0.912; 7 0.5,-0.912; 12 0.5,0.912; 13 0,0.912; 14 -0.5,0.912
CRYSTAL-SMD-5X3 = smd 1.9 x 1.1: 1 -1.85,-1.15; 2 1.85,-1.15; 3 1.85,1.15; 4 -1.85,1.15

### Placement (x,y rotation side)
A1  63.39,82.82 336 top
B1  64.6,79.6 270 top
B2  66.1,43.1 0 top
C1  57.1,65.1 0 top
C2  55.6,74.6 0 top
C3  60.1,79.6 0 top
C4  79.1,70.1 0 top
C5  79.1,73.1 0 top
C6  55.6,69.6 0 top
C7  73.6,76.1 0 top
C8  64.6,82.6 0 top
C9  52.1,51.6 0 top
C10  68.1,60.6 0 top
C11  58.1,62.1 0 top
C12  42.1,74.6 0 top
C13  59.6,50.6 0 top
C15  59.1,42.6 0 top
C17  65.1,50.6 0 top
D1  50.1,48.6 0 top
D2  47.6,78.1 0 top
D3  83.6,45.6 270 top
D4  42.1,47.6 270 top
D5  45.6,82.1 180 top
D6  49.6,68.1 0 top
D7  80.6,83.6 270 top
D8  31.1,63.1 0 bottom
D9  49.6,58.1 0 top
D10  34.1,91.6 0 bottom
D11  60.6,59.1 0 bottom
D12  90.6,90.1 0 bottom
D13  95.1,63.1 0 bottom
D14  89.6,37.1 0 bottom
D15  63.1,34.1 0 bottom
D16  38.1,38.6 0 bottom
DECO1  63.1,137.1 0 top  (outside the outline)
H1  51.6,43.1 0 top
H2  51.6,83.1 0 top
H3  74.6,43.1 0 top
H4  74.6,83.1 0 top
J1  91.1,63.1 90 top
J2  74.6,61.1 90 top
J3  84.1,51.1 90 top
J4  59.1,56.6 0 top
LG1  [VORTEX-LOGO]  62.97,42.43 0 bottom
M1  92.1,92.1 140 top
M2  92.1,34.1 50 top
M3  34.1,34.1 320 top
M4  34.1,92.1 230 top
NB1  61.1,40.6 0 top
Q1  85.6,87.1 270 top
Q2  86.6,40.1 180 top
Q3  43.1,42.1 90 top
Q4  40.1,85.6 0 top
Q5  35.6,61.1 0 top
Q6  35.6,66.1 0 top
Q7  80.1,58.6 0 bottom
Q8  63.1,39.1 0 bottom
Q9  42.1,62.6 0 bottom
R1  78.6,76.1 180 top
R2  78.6,79.1 180 top
R3  38.6,56.1 0 top
R4  40.6,68.1 0 top
R5  47.1,53.6 0 top
R6  41.1,71.1 0 top
R7  79.1,53.1 0 bottom
R8  42.1,66.6 0 bottom
R9  79.1,63.1 0 bottom
R10  58.1,40.1 0 bottom
R11  69.1,39.1 0 bottom
R12  42.1,58.6 0 bottom
R16  30.6,61.6 180 top
R17  30.6,64.6 180 top
R18  68.1,57.6 0 top
R19  68.1,63.6 0 top
R20  79.1,46.6 0 top
R21  45.1,85.6 0 top
R22  46.1,48.1 90 top
R23  81.1,40.1 180 top
R24  84.6,82.1 270 top
RG1  60.1,46.6 0 top
S1  61.33,31.27 300 top
SW1  73.1,51.6 90 top
U1  64.6,71.6 270 top
U2  63.1,63.1 0 top
Y1  74.1,71.1 90 top

### Tracks (layer width: path | path; a pad name or v marks a point on that pad's centre or on a via)
3V  (via drill 0.2, 0.35)
  Top 0.254: U1.54 68.1,70.35 v67.35,69.6 | v67.35,69.6 67.35,72.1 68.1,72.85 U1.59 70.52,72.85 70.78,73.1 v70.84,73.1 | U1.23 63.1,72.35 v63.35,72.6 | 66.35,64.35 66.6,64.35 67.1,63.85 67.1,63.6 R19.1 | 66.35,64.35 v65.6,64.35 | U2.12 63.6,64.1 63.64,64.14 v63.64,64.7 | U1.34 61.35,65.6 61.47,65.47 v61.49,65.47 | 66.35,64.35 U1.44 66.35,67.6 67.1,68.35 67.1,69.35 v67.35,69.6 | C13.1 58.85,50.6 58.85,48.35 59.1,48.1 RG1.5 59.35,47.85 61.35,49.85 61.35,50.6 v61.6,50.6 C17.1 | v67.1,59.02 67.14,58.98 R18.1 | C1.1 56.2,63.53 v55.18,62.51 | C10.1 v66.04,60.6 | U2.5 v62.59,61.49 | v56.35,61.35 57.1,62.1 C11.1 | v54.1,59.6 55.1,58.6 J4.4 | U2.8 64.79,62.35 64.88,62.43 v65.2,62.43 | v54.65,76.39 54.65,74.65 C2.1 | R20.1 76.77,46.6 73.9,49.46 v73.9,49.48
  Bottom 0.254: v63.35,72.6 66.35,69.6 v67.35,69.6 | J3.10 84.1,73.85 83.35,73.1 v70.84,73.1 | v54.1,59.6 55.18,60.68 55.18,61.35 | 55.18,61.35 v55.18,62.51 | 55.18,61.35 v56.35,61.35 | v61.6,50.6 61.6,53.85 63.85,56.1 63.85,60.85 63.1,60.85 62.6,61.35 v62.59,61.49
  pour Route15: 55.7,47.85 72.49,47.85 78.85,54.2 78.85,74.99 72.99,80.85 53.7,80.85 48.35,75.49 48.35,55.2
BAT_GND  (via drill 0.61, 0.76)
  Top 0.762: M1.G1 94.53,93.07 v94.33,93.27 | v45.16,74.9 43.74,74.9 C12.2 | R1.1 v80.62,76.1 | C15.2 60.07,42.51 v61.57,42.51 60.6,41.54 60.6,40.85 NB1.1 | M3.G1 31.66,34.99 v30.52,33.63 | R6.1 40.14,69.52 v40.16,69.51 | v91.92,96.8 91.92,96.4 M1.G2 | v34.42,30.61 35.22,30.68 M3.G2 | v64.1,36.6 62.46,34.96 S1.A | Q1.S 83.36,84.91 v83.28,84.91 | Q3.S 44.96,42.18 45.07,42.18 45.31,41.93 v45.42,41.93 | Q5.S 36.55,59.6 v37.47,58.68 | Q6.S 36.55,64.51 v37.49,63.57 | R3.1 37.64,56.89 38.59,57.84 v38.59,57.89 | M2.G1 90.85,30.87 v93.02,30.87 | M2.G2 95.44,35.22 v95.44,34.24 | v86.56,42.68 86.56,42.11 86.51,42.07 86.51,41.96 Q2.S | v33.56,95.19 35.47,95.19 M4.G1 | v30.12,91.7 32.05,89.77 M4.G2 | v40.04,83.38 40.04,83.49 40.18,83.62 40.18,83.73 Q4.S
  Bottom 0.762: R8.1 v44.35,66.6 | Q9.S v41.15,60.24 | R10.1 59.6,40.1 v60.6,39.1 60.89,39.1 61.42,38.56 61.68,38.56 Q8.S | R7.1 81.32,53.1 v81.33,53.08 | Q7.S 80.01,56.73 80.01,56.62 80.52,56.12 v80.85,56.12
  pour Route2: 34.92,21.67 95.06,21.67 108.87,35.48
  pour Route2: 55.08,46.52 55.05,46.53 47.53,54.05 47.52,54.08 47.52,85.07 39.56,97.01 20.17,95.03 18.17,64.11 28.66,44.63 28.67,44.62 28.67,44.62 28.67,44.62 28.67,44.6 31.16,20.17 63.08,19.67 84.56,28.66 84.57,28.67 84.58,28.67 84.58,28.67 84.59,28.67 104.17,31.03 108.02,63.58 97.53,84.56 97.52,84.57 97.52,84.57 97.52,84.57 97.52,84.59 95.04,105.93 71.97,83.41 80.15,75.15 80.16,75.14 80.16,75.14 80.16,75.14 80.17,75.12 80.17,75.11 80.17,75.11 80.17,75.11 80.17,75.1 80.17,53.58 80.16,53.55 73.14,46.53 73.11,46.52
BLU  (via drill 0.2)
  Top 0.127: v43.1,55.35 45.1,53.35 v45.1,52.6
  Bottom 0.127: 45.6,52.1 59.12,52.1 62.04,55.02 62.04,58.32 D11.B | 45.6,52.1 41.1,47.6 40.6,47.6 | 40.6,47.6 40.6,43.81 38.73,41.94 38.73,37.96 38.77,37.92 D16.B 39.77,37.6 43.1,37.6 44.6,39.1 57.75,39.1 59.02,37.82 60.05,37.82 D15.B 66.42,33.42 66.6,33.6 66.6,36.29 68.71,38.41 68.71,39.02 70.29,40.6 80.51,40.6 85.4,35.7 90.23,35.7 D14.B 92.27,35.1 93.1,35.1 94.1,36.1 94.1,36.2 87.32,42.98 87.32,54.21 87.37,54.27 87.37,55.15 87.8,55.57 88.17,55.57 93.48,60.87 94.9,60.87 D13.B 97.16,63.14 97.16,64.36 97.03,64.49 95.7,64.49 95.1,65.1 93.87,66.32 91.37,66.32 86.15,71.54 86.15,81.86 91.95,87.66 D12.B | D8.B 34.03,62.42 | 34.03,62.42 41.32,69.71 41.32,81.15 35.45,87.02 D10.B | 40.6,47.6 40.6,50.18 40.6,52.7 39.26,54.03 39.26,59.83 38.92,60.18 37.06,60.18 36.17,59.29 34.91,59.29 34.1,60.1 34.1,62.35 34.03,62.42 | v43.1,55.35 43.1,58.6 R12.1 | 45.6,52.1 v45.1,52.6
GND  (via drill 0.2, 0.35)
  Top 0.254: 65.6,82.6 C8.2 | R24.2 84.64,81.1 | U1.35 61.85,67.6 61.6,67.85 60.85,67.85 60.85,67.1 | v59.35,65.35 59.1,65.1 C1.2 | U1.45 66.85,64.85 67.1,64.6 67.35,64.6 v67.35,64.85 | 69.45,72.32 U1.58 69.5,72.37 | 69.45,70.87 U1.55 | 74.35,76.1 C7.2 | U1.11 63.37,76.45 | 67.22,48.53 67.38,48.37 67.82,48.37 | 48.77,80.52 48.6,80.35 | 51.14,50.04 51.09,50.1 | v80.74,41.37 80.74,40.7 R23.2 | v60.1,66.6 60.21,66.71 U1.33 | 76.85,47.1 77.1,47.1 | 68.1,53.85 68.6,54.35 68.6,54.85 68.35,54.85 68.35,54.35 68.85,53.85 | 69.1,60.6 C10.2 | C3.1 59.36,79.43 v59.36,78.04
  Bottom 0.254: v60.1,66.6 60.1,66.1 v59.35,65.35 59.35,63.61 v59.3,63.57 | v78.6,78.85 76.47,76.72 76.47,76.47 v76.1,76.1 | v80.74,41.39 v80.74,41.37
  other vias: 71.1,64.1 61.6,71.6 60.1,44.1 61.1,63.1 63.2,61.51 68.1,57.85 69.1,58.85 53.6,80.6 31.6,29.6 62.1,30.1 100.6,31.1 83.6,79.1 90.1,58.6 54.1,55.1 51.6,78.1
  pour Route2: 55.63,47.67 72.56,47.67 79.02,54.13 79.02,75.06 70.06,84.02 56.63,84.02 48.17,75.56 48.17,55.13
  pour Top: 31.16,20.17 63.08,20.17 84.56,28.66 84.57,28.67 84.58,28.67 84.58,28.67 84.59,28.67 104.03,31.16 108.02,63.58 97.53,84.56 97.52,84.57 97.52,84.57 97.52,84.57 97.52,84.59 95.04,105.93 72.65,84.04 72.64,84.03 72.64,84.03 72.64,84.03 72.62,84.02 72.61,84.02 72.61,84.02 72.61,84.02 72.59,84.02 53.6,84.02 53.58,84.02 53.58,84.02 53.58,84.02 53.57,84.02 53.55,84.03 53.55,84.03 53.55,84.03 53.54,84.04 39.57,97.02 20.17,95.03 18.17,64.11 28.66,44.63 28.67,44.62 28.67,44.62 28.67,44.62 28.67,44.6
  pour Bottom: 31.16,20.17 63.08,20.17 84.56,28.66 84.57,28.67 84.58,28.67 84.58,28.67 84.59,28.67 104.03,31.16 108.02,63.58 97.53,84.56 97.52,84.57 97.52,84.57 97.52,84.57 97.52,84.59 95.04,105.93 72.65,84.04 72.64,84.03 72.64,84.03 72.64,84.03 72.62,84.02 72.61,84.02 72.61,84.02 72.61,84.02 72.59,84.02 53.6,84.02 53.58,84.02 53.58,84.02 53.58,84.02 53.57,84.02 53.55,84.03 53.55,84.03 53.55,84.03 53.54,84.04 39.57,97.02 20.17,95.03 18.17,64.11 28.66,44.63 28.67,44.62 28.67,44.62 28.67,44.62 28.67,44.6
GRN  (via drill 0.2)
  Top 0.127: v89.6,62.1 90.1,61.6 v90.6,61.6
  Bottom 0.127: D15.G 61.16,34 56.62,38.54 44.83,38.54 43.22,36.93 38.74,36.93 37.75,37.92 D16.G 34.77,37.92 34.6,38.1 34.6,38.6 39.76,43.76 39.76,46.11 39.78,46.14 39.78,46.51 39.6,46.7 39.6,52.91 31.91,60.6 29.1,60.6 27.1,62.6 27.1,64.6 30.1,64.6 30.6,65.1 30.6,65.6 31.82,66.82 33.82,66.82 39.04,72.04 39.04,79.65 37.6,81.1 | D14.G 87.27,36.42 86.1,37.6 86.1,39.1 85.1,40.1 85.1,49.6 85.6,50.1 85.6,56.6 v90.6,61.6 91.42,62.42 D13.G 93.16,63 93.1,63 92.29,63.82 90.5,63.82 90.49,63.8 88.21,63.8 84.46,67.56 83.55,67.56 82.78,68.33 82.78,69.42 83.73,70.37 84.53,70.37 85.59,71.44 85.59,78.09 85.6,78.1 85.6,82.1 89.25,85.75 89.25,87.75 D12.G 88.66,90 88.64,90 88.41,90.23 85.23,90.23 81.6,86.6 79.6,86.6 76.62,83.62 76.62,80.48 73.24,77.1 42.6,77.1 | D8.G 30.73,62.42 30.73,63.86 32.86,65.99 33.78,65.99 39.6,71.81 39.6,82.15 32.74,89 32.75,89.01 D10.G 33.33,91.5 33.34,91.5 34.82,92.99 36.03,92.99 36.16,92.86 36.16,88.53 41.6,83.1 41.6,69.6 34.6,62.6 34.6,60.1 35,59.69 36.18,59.69 37.03,60.54 39.28,60.54 39.54,60.28 39.54,54.65 41.1,53.1 58.48,53.1 61.51,56.12 61.51,57.55 61.23,57.83 61.23,59.04 59.83,60.44 58.66,60.44 58.53,60.31 58.53,59.13 58.66,59 60.33,59 60.42,58.91 60.42,58.42 | 60.42,58.42 D11.G | 42.6,77.1 42.6,83.99 37.04,89.54 37.1,89.6 37.1,94.1 33.32,94.1 31.53,92.31 31.53,89.07 | 42.6,77.1 42.6,69.77 37.9,65.07 37.9,64.1 38.16,63.85 38.16,63.29 37.77,62.89 37.17,62.89 35.15,60.87 35.15,60.51 35.41,60.25 35.78,60.25 36.04,60.51 36.04,60.57 36.57,61.1 39.51,61.1 40.1,60.51 40.1,55.12 41.12,54.1 57.97,54.1 59.5,55.62 59.5,57.5 60.42,58.42
  Bottom 0.127: v89.6,62.1 89.35,62.35 81.1,62.35 80.35,63.1 R9.1
  Bottom 0.15: 31.53,89.07 37.5,83.1 37.5,81.19 37.6,81.1
MISO  (via drill 0.2)
  Top 0.127: v60.93,69.03 62.61,69.03 63.86,67.78 63.86,66.73 U1.39 | v54.85,71.35 53.35,72.85 53.35,73.93 v53.22,74.06 | v57.85,77.6 v57.85,76.6 | v77.1,83.35 v76.35,84.1 | v84.85,75.1 85.6,74.35 v85.6,69.1 | J1.1 93.6,60.6 92.35,60.6 91.84,61.1 91.84,62.85 v90.1,64.6
  Bottom 0.127: v54.85,71.35 56.1,70.1 59.85,70.1 60.85,69.1 v60.93,69.03 | v57.85,77.6 73.35,77.6 76.35,80.6 v76.35,84.1 | v77.1,83.35 77.1,79.35 79.1,79.35 79.1,77.1 79.22,76.97 81.97,76.97 83.85,75.1 v84.85,75.1 | v90.1,64.6 v85.6,69.1 | v57.85,76.6 55.85,76.6 53.31,74.06 v53.22,74.06
MOSI  (via drill 0.2)
  Top 0.127: v60.93,68.4 62.75,68.4 63.37,67.78 63.37,66.73 U1.38 | v82.1,73.85 82.1,67.6 84.6,67.6 85.35,66.85 85.35,66.1 87.35,64.1 87.35,63.1 88.6,63.1 J1.4 | v66.85,74.6 65.35,73.1 v62.35,73.1 | v61.1,71.1 61.35,70.85 v61.35,69.6
  Bottom 0.127: v82.1,73.85 81.35,74.6 v66.85,74.6 | v62.35,73.1 60.85,71.6 60.85,71.1 v61.1,71.1 | v61.35,69.6 61.85,69.1 61.85,68.35 61.1,68.35 v60.93,68.4
N$1  (via drill 0.2)
  Top 0.127: v49.35,63.35 52.35,60.35 52.35,56.1 50.1,53.85 50.1,49.6 49.1,48.6 D1.A | v45.85,70.6 45.35,71.1 45.35,71.85 44.35,72.85 41.85,72.85 41.1,72.1 39.6,72.1 39.1,71.6 v39.1,69.6 | v33.35,63.1 31.85,61.6 R16.1
  Bottom 0.127: v49.35,63.35 49.35,69.6 46.85,69.6 v45.85,70.6 | v39.1,69.6 39.1,68.1 34.1,63.1 v33.35,63.1
N$2  (via drill 0.2)
  Top 0.127: v52.6,76.1 52.6,77.1 47.6,77.1 46.6,78.1 D2.A | v43.1,70.35 42.85,70.1 42.85,67.1 v41.1,65.35 | R17.1 31.6,64.6 31.6,63.85 30.87,63.12 30.87,60.95 31.14,60.69 32.67,60.69 33.65,59.71 33.65,59.14 34.25,58.54 36.26,58.54 36.6,58.2 36.6,55.6 37.35,54.85 39.85,54.85 40.31,55.3 v40.6,55.3
  Bottom 0.127: v43.1,70.35 43.1,71.85 44.51,73.26 49.76,73.26 v52.6,76.1 | v41.1,65.35 40.61,64.86 40.56,64.86 40.43,64.73 40.43,59.33 40.38,59.28 40.38,55.52 v40.6,55.3
N$3
  Top 0.254: U1.8 64.87,76.5 64.87,77.39 65.4,77.92 B1.4
N$4
  Top 0.254: U1.9 64.32,76.5 64.32,77.39 63.8,77.92 B1.3
N$5
  Top 0.254: C3.2 B1.2
N$6
  Top 0.254: U1.57 71.85,71.85 Y1.3 74.17,74.17 77.12,74.17 C5.1
N$7
  Top 0.254: U1.56 73.15,71.35 Y1.1 76.1,70.1 C4.1
N$8
  Top 0.254: C7.1 70.54,73.93 70.54,73.52 70.37,73.35 U1.60
N$9
  Top 0.127: 58.1,72.87 59.67,72.87 U1.22 | 58.1,72.87 57.48,72.87 55.41,70.8 55.39,70.8 54.96,70.37 54.96,69.85 C6.1 | U1.21 58.07,73.35 58.07,72.9 58.1,72.87
N$10
  Top 0.127: B1.1 63.8,80.7
  Top 1.27: 63.8,80.7 63.8,82.41 A1.FEED 63.72,82.58 C8.1
N$11  (via drill 0.2)
  Top 0.127: v75.67,63.72 75.67,63.86 76.44,64.63 76.44,64.84 J2.1 | v52.1,50.85 51.35,51.6 C9.1 | v64.35,54.1 65.6,55.35 v65.64,55.34
  Bottom 0.127: v75.67,63.72 75.67,61.98 74.97,61.28 74.55,61.28 73.57,60.3 73.57,59.28 68.91,54.62 66.1,54.62 65.64,55.09 v65.64,55.34 | v52.1,50.85 54.6,48.35 61.35,48.35 64.1,51.1 64.1,54.1 v64.35,54.1
N$12  (via drill 0.2)
  Top 0.127: v44.85,70.6 44.85,71.85 44.35,72.35 41.85,72.35 41.1,71.6 41.1,69.35 40.35,68.6 40.1,68.6 39.6,68.1 R4.1 | v48.35,61.85 50.85,59.35 50.85,58.1 D9.C
  Bottom 0.127: v44.85,70.6 44.85,67.1 48.35,63.6 v48.35,61.85
N$13
  Top 0.127: Q6.D 35.64,67.08 36.48,67.08 37.46,66.1 37.46,64.54 38.9,63.11 38.9,62.3 39.71,61.49 47.65,61.49 49.2,59.94 49.2,56.26 48.15,55.2 R5.2
N$14
  Top 0.762: D7.2 81.85,82.07 84.89,85.11 85.57,85.11 86.62,86.17 Q1.D 86.62,87.13 M1.2
N$15
  Top 0.762: D3.2 83.6,43.4 83.6,43.39 83.6,41.57 84.6,40.58 84.6,39.1 84.62,39.07 Q2.D 88.82,36.84 89.39,36.84 89.8,36.43 M2.2
N$16
  Top 0.762: M3.2 42.07,41.57 Q3.D 42.1,42.12 D4.2
N$17
  Top 0.762: D5.2 44.07,83.85 42.04,85.88 40.84,85.88 Q4.D 39.07,86.62 M4.2
N$18  (via drill 0.2)
  Top 0.127: v47.8,55.62 45.97,53.79 R5.1 45.85,53.6 45.85,54.6 v44.1,56.35 | v53.1,65.1 51.6,66.6 51.6,67.6 51.1,68.1 D6.C
  Bottom 0.127: v53.1,65.1 47.35,59.35 45.1,59.35 44.1,58.35 v44.1,56.35
N$19  (via drill 0.2)
  Top 0.127: v61.28,48.99 65.4,48.99 65.89,48.5 v65.89,47.77
  Bottom 0.127: v61.28,48.99 58.5,51.77 49.32,51.77 48.84,51.29 v45.6,51.29 | R9.2 80.17,60.97 Q7.D 80.35,59.6 83.35,59.6 83.85,60.1 84.35,60.1 85.17,59.27 85.17,52.97 84.61,52.41 82.07,52.41 78.7,49.04 73.42,49.04 72.32,47.94 66.05,47.94 v65.89,47.77
N$20
  Top 0.127: RG1.3 61.07,45.28 61.07,43.96 62.24,42.79 62.24,36.19 60.79,34.74 60.79,34.04 61.98,32.85 62.4,32.85 62.75,32.5 63.7,32.5 S1.C
N$22
  Bottom 0.127: Q8.D 64.12,39.1 R11.2
N$23  (via drill 0.2)
  Top 0.127: Q5.D 35.64,62.19 37.19,62.19 37.58,62.58 v38.08,62.58 | R4.2 41.1,68.1 38.35,65.35 v38.35,64.85
  Bottom 0.127: v38.08,62.58 38.08,62.81 38.44,63.17 38.44,63.96 38.44,64 38.35,64.1 v38.35,64.85
N$25
  Bottom 0.127: Q9.D 42.1,59.6 41.1,58.6 R12.2
PB4  (via drill 0.2, 0.61)
  Top 0.127: Q5.G 34.67,60.16 35.01,60.16 35.54,60.69 v35.6,60.69 | v43.82,71.48 42.42,71.48 42.07,71.13 R6.2 42.31,70.83 42.31,67.41 42.18,67.28 40.84,67.28 38.88,65.33 v38.88,63.81 | U1.40 64.35,66.73 64.35,67.85 61.84,70.36 61.84,70.64 63.17,71.97 66.45,71.97 v66.7,72.22
  Bottom 0.127: v43.82,71.48 45.32,72.98 55.66,72.98 59.07,76.39 62.29,76.39 66.46,72.22 v66.7,72.22 | v35.6,60.69 35.61,60.69 37.06,62.13 38.26,62.13 38.72,62.59 38.72,63.65 v38.88,63.81
PB5  (via drill 0.2)
  Top 0.127: 34.6,64.98 34.6,65.05 Q6.G 34.6,64.98 | v62.33,70.5 64.84,67.98 64.84,66.73 U1.41 | 34.6,64.98 33.76,65.82 33.76,68.12 34.04,68.4 34.32,68.4 34.46,68.54 34.81,68.54 38.75,72.49 41.05,72.49 42,73.44 42,75.81 42.94,76.75 51.75,76.75 52.15,76.35 52.15,75.91 53.17,74.9 53.17,74.83 53.67,74.33 53.67,73.22 54.11,72.78 55.05,72.78 55.16,72.66 55.16,72.4 v55.75,71.81 | 34.6,64.98 34.6,63.9 33.93,63.23 33.93,59.26 34.21,58.97 36.22,58.97 37.19,58 37.75,58 38.51,58.77 39.35,58.77 39.74,58.37 39.74,57.82 39.55,57.62 R3.2
  Bottom 0.127: v62.33,70.5 58.14,70.5 v57.23,71.41 56.16,71.41 v55.75,71.81
PB6  (via drill 0.2)
  Top 0.127: v65.47,65.54 65.33,65.68 65.33,66.66 U1.42
  Bottom 0.127: v65.47,65.54 66.73,64.28 66.73,63.51 66.73,59.79 66.65,59.71 66.65,57.29 66.3,56.94 66.3,55.09 v66.28,55.07 66.28,55.41 65.9,55.79 65.45,55.79 65.15,55.49 65.15,51.27 63.82,49.94 63.82,46.06 65.87,44.01 65.87,42.18 65.74,42.05 63.55,42.05 63.1,41.6 58.64,41.6 R10.2 59.14,38.1 60.59,38.1 61.56,37.13 62.73,37.13 63.7,38.1 Q8.G
PB7  (via drill 0.2)
  Top 0.127: v64.98,68.47 65.12,68.47 65.78,67.81 65.82,67.78 65.82,66.73 U1.43
  Bottom 0.127: v64.98,68.47 63.65,67.15 54.29,67.15 v47.8,60.65 46.85,61.6 44.1,61.6 | Q9.G 44.1,61.6 | R8.2 42.87,64.86 43.63,64.86 44.1,64.4 44.1,61.6
PF7
  Top 0.127: U1.6 65.89,76.51 65.89,77 65.82,77.1
  Top 0.254: R2.2 76.08,77.54 | 76.08,77.54 66.02,77.54 65.87,77.39 65.87,77.14 65.82,77.1 | 76.08,77.54 76.2,77.54 R1.2
PG0  (via drill 0.2)
  Top 0.127: v61.84,75.25 61.84,76.44 U1.14 | v38.6,73.35 39.6,74.35 39.6,75.35 43.35,79.1 51.22,79.1 53.44,76.88 53.44,74.94 53.94,74.44 53.94,73.94 54.22,73.67 55.77,73.67 v56.71,72.73 | R16.2 29.6,61.6 29.6,62.85 30.6,63.85 30.6,65.38 v32.48,67.27
  Bottom 0.127: v61.84,75.25 58.49,71.9 56.85,71.9 | v47.05,70.22 47.38,70.22 47.73,70.57 49.08,70.57 50.77,72.26 55.93,72.26 56.3,71.9 56.85,71.9 | v38.6,73.35 38.6,72.1 33.77,67.27 v32.48,67.27 | 56.85,71.9 56.85,72.6 v56.71,72.73
PG1  (via drill 0.2)
  Top 0.127: 57.93,70.1 57.93,71.97 v58.35,72.39 | v61.21,75.25 61.35,75.39 61.35,76.44 U1.15 | v39.99,62.6 40.1,62.6 41.29,63.79 49.53,63.79 49.72,63.6 54.1,63.6 | v38.6,61.6 v38.6,59.6 | R17.2 28.6,64.6 28.6,61.1 29.1,60.6 30.6,60.6 30.83,60.6 31.02,60.41 32.56,60.41 33.37,59.6 33.37,59.02 34.3,58.1 36.07,58.1 v36.08,58.08
  Top 0.152: 54.1,63.6 54.1,65.27 57.93,69.1 57.93,70.1
  Bottom 0.127: v61.21,75.25 v58.35,72.39 | v39.99,62.6 38.99,61.6 v38.6,61.6 | v36.08,58.08 36.79,58.79 36.79,58.95 37.44,59.6 v38.6,59.6
PG2  (via drill 0.2)
  Top 0.127: v60.3,75.95 60.79,76.44 U1.16 | v81.6,55.1 81.1,54.6 80.6,54.6 v80.37,54.37 | v82.85,59.1 82.6,59.35 v82.6,60.1 | v80.1,64.35 79.85,64.6 v79.85,65.6
  Bottom 0.127: v60.3,75.95 62.34,75.95 66.59,71.69 69.72,71.69 76.02,65.4 79.85,65.4 v79.85,65.6 | v81.6,55.1 82.1,55.1 82.1,56.62 Q7.G 81.35,57.6 v82.85,59.1 | R7.2 78.73,53.1 79.64,54 80,54 v80.37,54.37 | v82.6,60.1 81.35,61.35 80.35,61.35 79.35,62.35 79.35,64.35 v80.1,64.35
PWM1  (via drill 0.2, 0.61)
  Top 0.127: v78.74,66.17 78.53,66.38 70.99,66.38 69.52,67.85 U1.49 | v79.14,82.06 80,82.92 81.2,82.92 81.33,83.05 81.33,84.78 Q1.G 84.79,88.05 85.51,88.76 85.76,88.76 v86.1,89.1 | R24.1 84.6,83.1 v85.6,84.1
  Bottom 0.127: v78.74,66.17 84.05,71.48 J3.9 84.12,71.48 84.12,72.04 85.31,73.22 85.31,75.89 v79.14,82.06 | v86.1,89.1 86.1,84.6 v85.6,84.1
PWM2  (via drill 0.2, 0.61)
  Top 0.127: 84.64,62.57 85.31,63.24 85.31,64.44 84.12,65.62 84.12,66.31 J3.7 | 84.64,62.57 84.61,62.54 83.63,62.54 79.51,66.66 72,66.66 70.4,68.26 69.56,68.26 U1.50 | 84.64,62.57 85.31,61.91 85.31,61.1 86.45,59.96 86.45,55.6 v86.88,55.16 | Q2.G 87.6,41.1 87.6,42.6 86.84,43.35 86.84,44.24 v86.64,44.45 84.52,44.45 84.2,44.77 82.99,44.77 82.87,44.64 82.87,42.37 82.05,41.55 R23.1
  Bottom 0.127: v86.88,55.16 86.84,55.13 86.84,44.65 v86.64,44.45
PWM3  (via drill 0.2, 0.61)
  Top 0.127: U1.51 69.52,68.82 70.3,68.82 72.18,66.94 80.35,66.94 83.42,63.86 84.05,63.86 J3.6 | v61.28,46.33 63.1,46.33 v65.26,48.5 | v75.04,58.83 75.18,58.69 78.56,58.69 81.54,61.68 81.54,62.05 v82.51,63.03 | 45.6,41.1 44.15,41.1 Q3.G | 45.6,41.1 49.13,41.1 v49.2,41.16 | R22.1 46.1,42.21 | 46.1,42.21 | 46.1,42.21 46.1,41.6 45.6,41.1
  Bottom 0.127: v82.51,63.03 83.28,63.79 84.05,63.79 J3.6 | v49.2,41.16 54.33,41.16 59.5,46.33 v61.28,46.33 | v75.04,58.83 76.72,57.15 76.72,56.64 79.12,54.24 79.12,54.12 79.1,54.1 79.05,54.05 77.64,54.05 77.64,53.92 77.46,53.74 77.46,52.45 78.6,51.32 78.6,50.1 74.31,50.1 74.2,50.21 73.6,50.21 71.89,48.5 v65.26,48.5
PWM4  (via drill 0.2)
  Top 0.127: 45.34,84.37 44.16,85.56 R21.1 | v77.83,65.89 80.91,62.82 80.91,62.05 v81.09,61.86 | 45.34,84.37 49.1,84.37 49.18,84.37 50.9,84.37 51.02,84.49 52.18,84.49 52.97,83.7 52.97,83.49 55.55,80.91 55.55,78.44 57.25,76.75 57.25,76.01 58.92,74.34 59.67,74.34 U1.19 59.74,74.41 60.44,74.41 60.65,74.2 60.79,74.34 60.86,74.34 61.51,73.69 65.24,73.69 v65.43,73.88 | Q4.G 39.15,83.05 39.6,82.6 43.1,82.6 43.37,82.32 43.37,81.49 43.5,81.37 44.64,81.37 44.77,81.49 44.77,83.8 45.34,84.37
  Bottom 0.127: v77.83,65.89 75.95,65.89 68.19,73.64 65.67,73.64 v65.43,73.88 | J3.5 83.49,61.86 v81.09,61.86 | v81.09,61.86
RED  (via drill 0.2)
  Bottom 0.127: 86.6,57.1 86.1,56.6 86.1,47.1 85.6,46.6 85.6,40.37 D14.R | 86.6,57.1 89.6,60.1 90.31,60.1 91.86,61.65 94.28,61.65 94.46,61.83 94.46,63.01 94.33,63.14 D13.R 93.37,64.1 90.39,64.1 90.38,64.08 88.32,64.08 84.57,67.83 83.66,67.83 83.05,68.44 83.05,69.31 83.84,70.1 84.64,70.1 85.87,71.33 85.87,81.98 90.1,86.2 90.1,90.1 89.47,90.72 D12.R 90.59,90.72 91.36,91.49 92.53,91.49 92.66,91.36 92.66,87.98 88.1,83.41 86.6,81.91 86.6,71.6 87.6,70.6 91.49,66.7 | 94.6,33.6 94.6,36.1 87.6,43.1 87.6,53.6 87.65,53.65 87.65,55.03 87.91,55.29 88.29,55.29 93.6,60.6 97.1,60.6 98.1,61.6 98.1,64.6 97.6,64.6 | 84.6,36.1 80.6,40.1 70.8,40.1 70.15,39.45 R11.1 69.8,39.1 67.1,36.4 67.1,32.6 63.88,32.6 62.33,34.14 D15.R 58.93,37.54 58.91,37.54 57.63,38.82 44.71,38.82 43.1,37.2 38.86,37.2 37.42,38.64 37.33,38.64 D16.R 36.75,40.35 40.1,43.7 40.1,50.07 40.32,50.3 40.32,52.58 32.03,60.87 29.99,60.87 28.22,62.64 28.22,63.72 D8.R 32.57,66.54 33.94,66.54 39.32,71.92 39.32,80.37 37.79,81.9 37.79,83.29 32.03,89.06 32.03,91.51 D10.R 33.79,93.27 36.15,93.27 36.44,92.98 36.44,88.65 41.87,83.21 41.87,69.44 34.87,62.44 34.87,60.39 35.3,59.97 35.9,59.97 36.75,60.82 39.4,60.82 39.82,60.39 39.82,54.87 41.1,53.6 58.59,53.6 61.23,56.24 61.23,57.44 60.95,57.72 60.95,58.78 60.13,59.6 59.37,59.6 D11.R | v88.1,56.6 87.1,56.6 86.6,57.1
  Bottom 0.15: 94.6,33.6 87.1,33.6 84.6,36.1 | 97.6,64.6 97.34,64.6 97.16,64.78 95.91,64.78 93.99,66.7 91.49,66.7
RESET  (via drill 0.2)
  Top 0.127: SW1.2 77.83,50.11 80.07,47.87 80.07,46.61 R20.2 80,46.54 79.65,46.54 78.6,45.49 74.21,45.49 70.37,49.34 68.59,49.34 SW1.1 68.94,50.33 67.19,52.09 v64.71,52.09 | U1.12 62.82,76.44 62.82,75.67 62.89,75.6 62.89,75.46 62.82,75.39 v62.82,74.13 63.03,74.35 64.6,74.35 v64.78,74.53 | v60.02,64.63 59.4,64.01 59.12,64.01 58.41,63.3 56.6,63.3 55.5,62.2 55.5,60.34 56.25,59.58 56.25,54.86 C9.2 | v90.35,66.6 91.6,66.6 92.35,65.85 93.6,65.85 J1.5 | v85.1,69.6 84.6,70.1 82.6,70.1 v82.6,70.85
  Bottom 0.127: v62.82,74.13 62.82,71.27 65.47,68.61 65.47,68.12 64.91,67.57 64.91,66.47 | v60.02,64.63 61.86,66.47 64.91,66.47 | v64.71,52.09 64.87,52.25 64.87,57.54 65.16,57.83 65.16,60.36 64.76,60.76 64.76,62.88 64.91,63.03 64.91,66.47 | v90.35,66.6 87.35,69.6 v85.1,69.6 | v82.6,70.85 80.85,72.6 69.85,72.6 68.35,74.1 65.84,74.1 65.61,74.33 64.98,74.33 v64.78,74.53
RX0  (via drill 0.2)
  Top 0.127: v67.36,65.54 67.43,65.61 67.29,65.75 67.29,65.82 67.36,65.89 67.36,66.66 U1.46 | v73.99,64 74.55,63.44 74.97,63.44 75.67,62.75 75.67,60.58 76.44,59.81 J2.3
  Bottom 0.127: v67.36,65.54 72.46,65.54 v73.99,64
SCK  (via drill 0.2)
  Top 0.127: v62.26,67.92 62.75,67.92 62.82,67.85 62.82,67.78 62.89,67.71 62.89,66.73 U1.37 | v95.85,60.1 95.85,61.35 95.1,62.1 95.1,62.85 93.85,62.85 J1.3 | v88.1,54.85 85.85,52.6 84.6,52.6 84.35,52.35 83.6,52.35 83.35,52.6 82.1,52.6 81.7,52.2 v81.24,52.2 | v66.1,49.1 65.1,50.1 65.1,51.1 64.6,51.6 63.6,51.6 58.85,56.35 58.85,58.1 55.85,61.1 55.85,61.6 56.1,61.85 v56.1,62.1 | v57.6,68.1 56.6,67.1 v56.6,66.19
  Bottom 0.127: v95.85,60.1 95.35,59.6 93.1,59.6 88.35,54.85 v88.1,54.85 | v57.6,68.1 57.85,67.85 62.1,67.85 v62.26,67.92 | v66.1,49.1 65.94,48.94 65.08,48.94 64.82,48.68 64.82,48.31 65.08,48.05 65.44,48.05 65.61,48.22 72.01,48.22 73.72,49.93 74.09,49.93 74.2,49.82 78.85,49.82 v81.24,52.2 | v56.6,66.19 56.6,66.1 56.1,65.6 v56.1,62.1
SCL  (via drill 0.2)
  Top 0.127: 60.69,64.67 v61,64.35 60.65,64 60.65,61.78 61.86,60.57 63.3,60.57 64.71,61.98 67.57,61.98 69.03,63.44 69.03,63.51 | U1.25 59.67,71.34 59.6,71.27 58.97,71.27 58.83,71.41 58.76,71.41 58.42,71.06 58.42,66.94 60.69,64.67 | 69.03,63.51 69.03,63.58 R19.2 69.03,63.51 | v74.97,60.79 74.62,61.14 71.41,61.14 69.03,63.51 | 60.69,64.67 59.75,63.73 59.75,61.44 60.37,60.82 J4.2 | v63.01,64.7 63.1,64.62 U2.13
  Bottom 0.127: v61,64.35 61.35,64.7 v63.01,64.7 | J3.2 84.05,53.67 81.7,53.67 79.44,55.93 77.83,55.93 77,56.76 77,58.76 v74.97,60.79
SDA  (via drill 0.2)
  Top 0.127: U1.26 59.67,70.85 58.69,70.85 58.69,67.22 60.93,64.98 v61,64.98 61.62,64.98 U2.14 | J3.3 84.05,56.18 83.49,56.18 81.33,58.35 72.23,58.35 71.78,58.79 70.25,58.79 R18.2 67.96,58.69 67.96,61.25 67.51,61.7 64.87,61.7 63.46,60.29 61.6,60.29 | v60.19,62.27 60.19,61.64 61.54,60.29 61.6,60.29 | J4.1 62.85,54.85 61.85,55.85 61.85,60.1 61.6,60.35 61.6,60.29
  Bottom 0.127: v60.19,62.27 60.19,64.17 v61,64.98
TX0  (via drill 0.2)
  Top 0.127: v67.98,63.03 67.98,64.35 67.85,64.49 67.85,66.66 U1.47 | J2.4 72.73,57.3 71.69,58.35 v71.1,58.35
  Bottom 0.127: v71.1,58.35 71.1,59.92 v67.98,63.03
VBAT  (via drill 0.61, 0.76)
  Top 0.762: v80.52,87.75 80.52,85.2 D7.1 | M4.1 38.03,90.34 38.07,90.4 38.84,91.31 v38.91,91.32 | M2.1 89.44,35.54 v88.64,34.58 | D4.1 42.13,49.16 v42.13,50.35 | C15.1 58.16,42.64 v56.76,42.64 | v92.93,92.63 92.93,91.63 90.76,89.46 M1.1 | v65.61,34.39 66.03,33.97 66.03,32.36 65.4,31.73 65.4,30.69 65.23,30.51 S1.B | C12.1 40.76,73.27 v40.64,73.16 | RG1.1 v59.18,43.83 | R2.1 v80.99,79.1 | v83.6,48.48 D3.1 | D9.A v45.85,58.1 | D6.A v45.85,68.1 | v47.15,83.49 47.15,82.13 D5.1 | v34.82,39.9 34.82,37.38 M3.1
  Bottom 0.762: D15.A 65.4,34.77 65.61,34.46 v65.61,34.39 | D16.A 40.4,39.27 40.6,39 41.09,38.51 41.37,38.51 42.07,39.21 42.49,38.79 42.49,38.56 v42.78,38.27 | D13.A 96.06,63.79 95.43,63.79 93.84,65.38 v91.29,65.38 | D14.A 89.74,38.97 v89.74,39.17 | D8.A 32.51,63.77 v33.47,64.72 | B2.2 v69.6,43.1 | 50.58,56.1 52.22,56.1 57.16,61.03 60.68,61.03 D11.A | 50.58,56.1 v50.58,55.74 | D12.A 91.63,90.45 91.22,90.45 90.91,90.14 90.91,88.7 91.1,88.52 v91.1,88.1 | D10.A 34.95,92.27 34.1,91.42 v34.1,90.6 | v45.85,58.1 48.6,58.1 50.35,56.35 50.58,56.1
  pour Route15: 55.08,46.52 55.05,46.53 47.53,54.05 47.52,54.08 47.52,87.57 39.56,97.02 20.17,95.03 18.17,64.11 28.66,44.63 28.67,44.62 28.67,44.62 28.67,44.62 28.67,44.6 31.16,20.17 63.08,20.17 84.56,28.66 84.57,28.67 84.58,28.67 84.58,28.67 84.59,28.67 104.03,31.16 108.02,63.58 97.53,84.56 97.52,84.57 97.52,84.57 97.52,84.57 97.52,84.59 95.04,105.93 73.17,84.56 73.17,82.13 80.16,75.14 80.17,75.11 80.17,53.58 80.16,53.55 73.14,46.53 73.11,46.52
(copper drawn outside any net)
  shapes: Route15 area x1, Route2 area x1

### Text on the board
tDocu: width: 126.2 mm